# EasyEDA Pro project 示波器_V2.eprj, schematic Schematic1

## Sheets
1 MCU: Board Name: Board1; Create Date: 2023-11-27; Page Name: MCU; Project Name: 手持式多功能示波器; Schematic Name: Schematic1; Update Date: 2025-04-08; Drawed: 一叶知秋; Page Size: A4; Reviewed: 一叶知秋; Version: V1.0
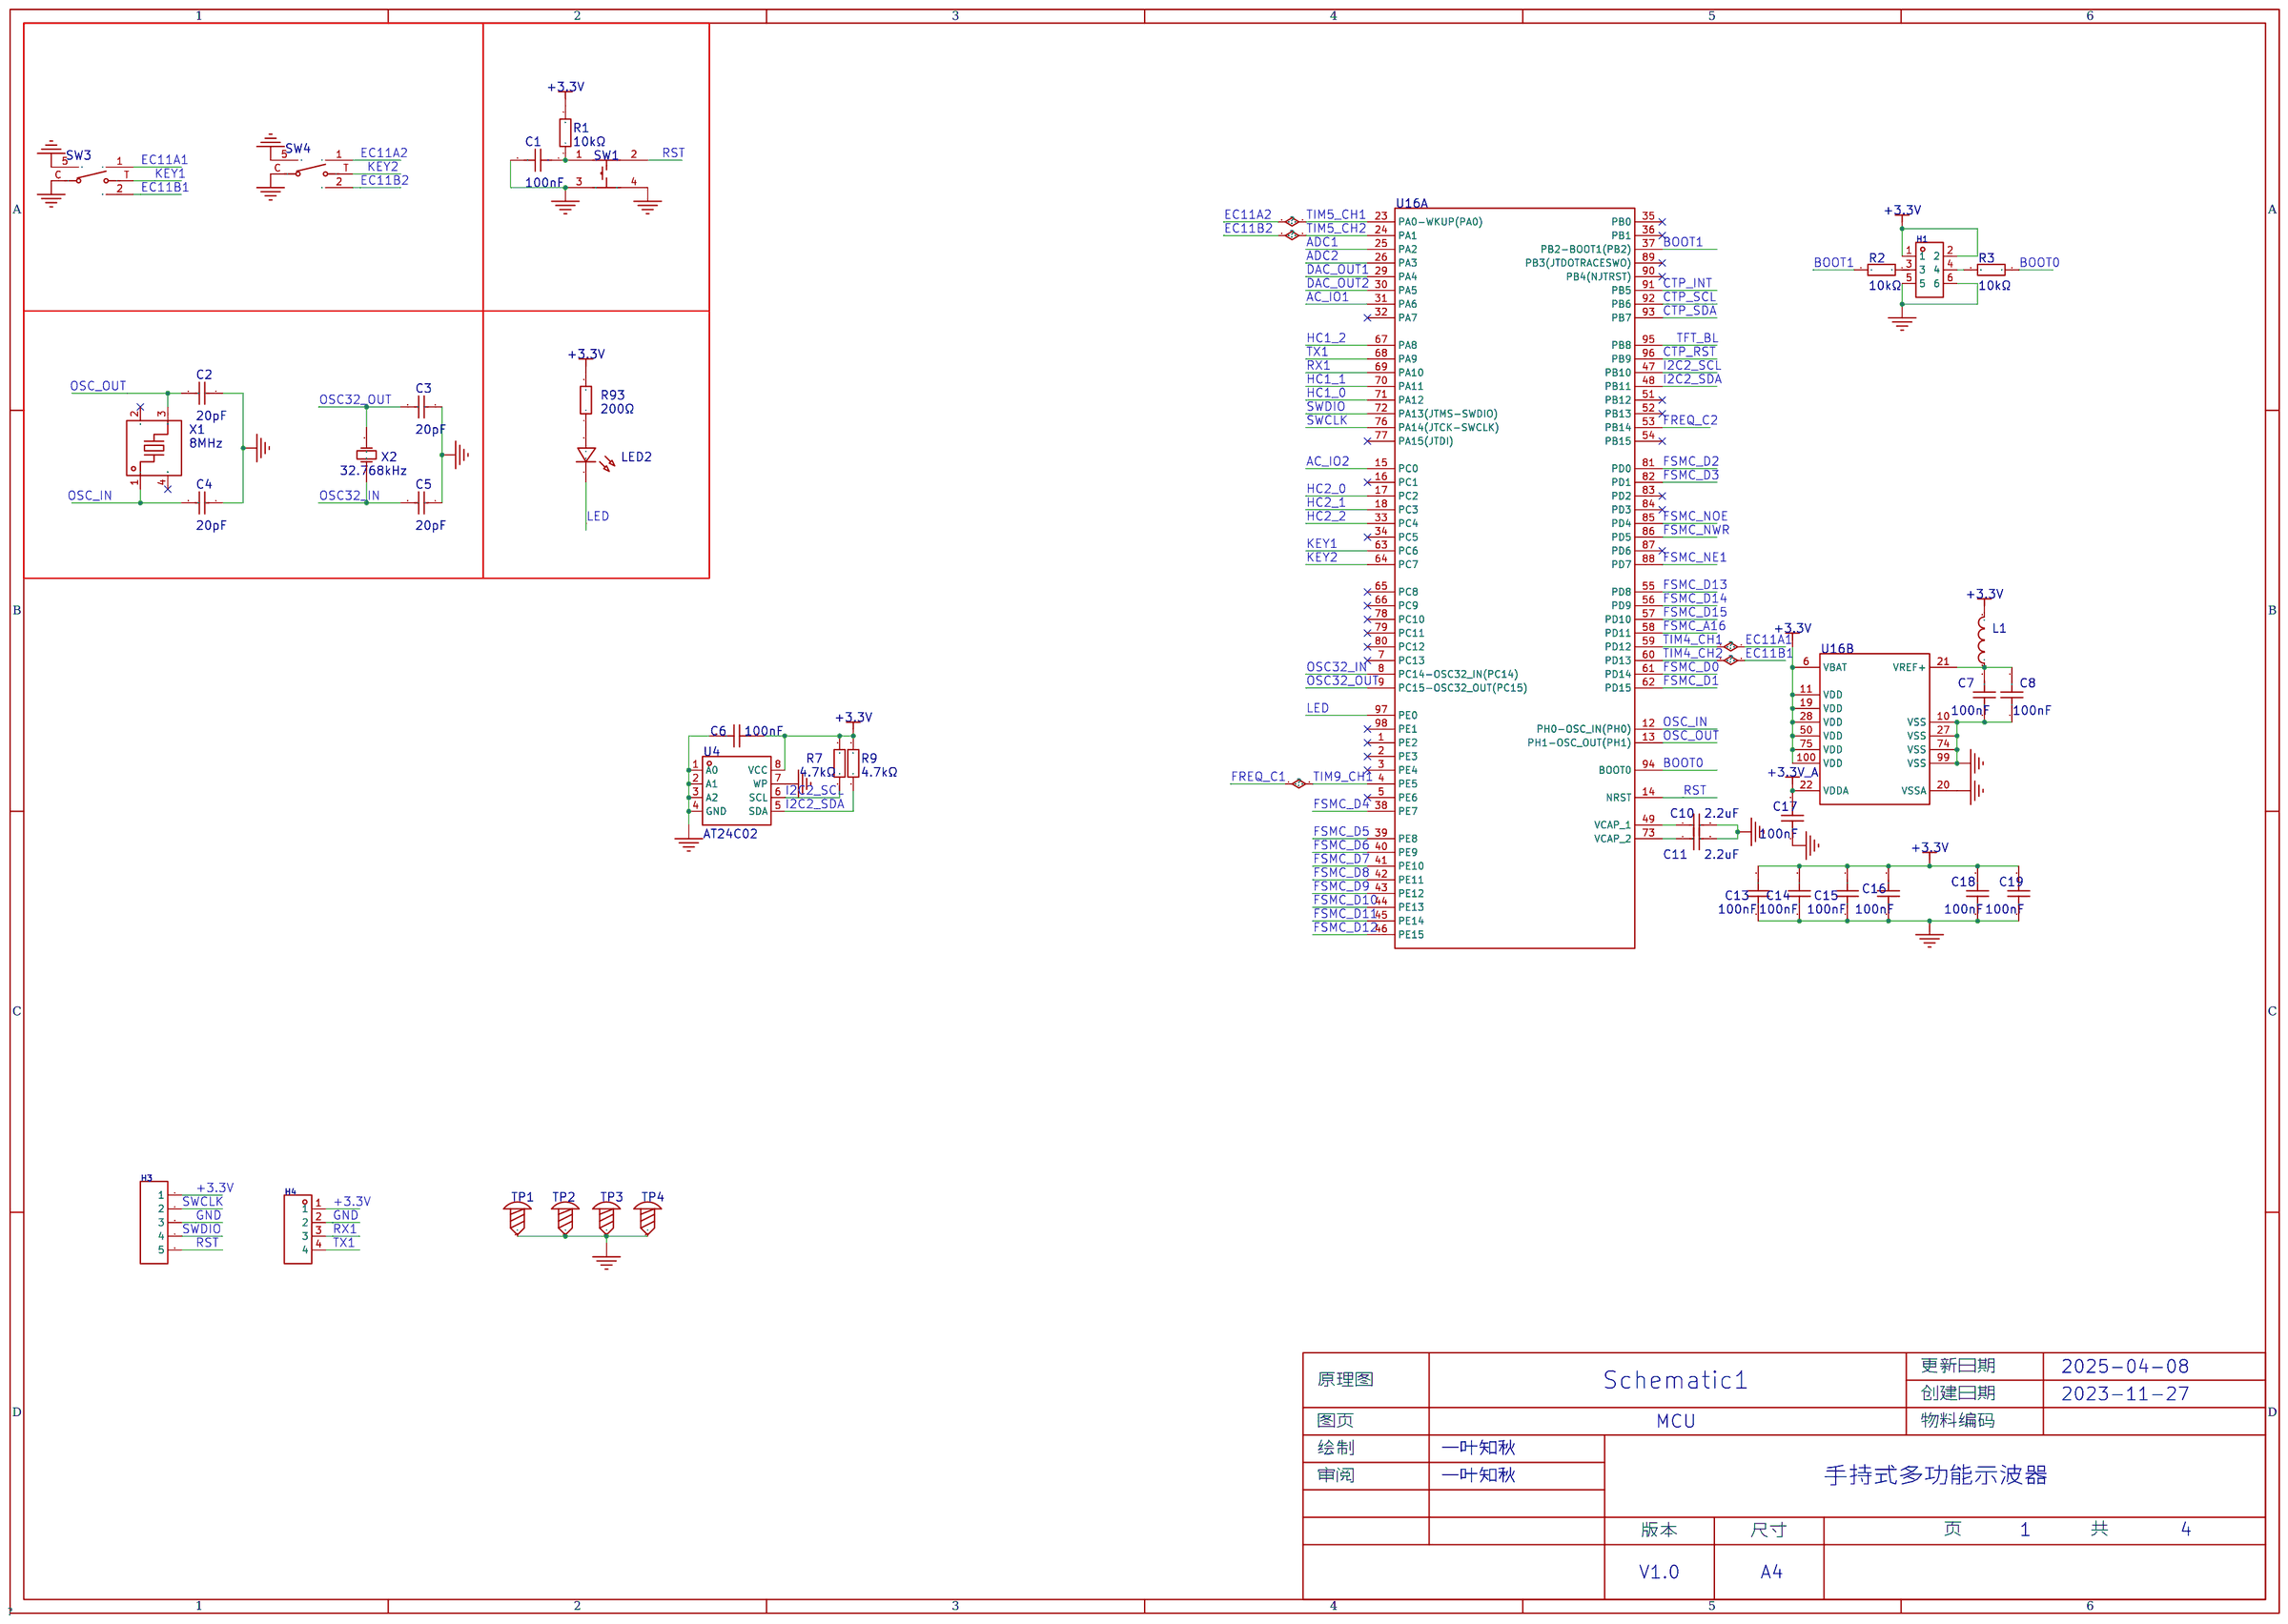
[diagram p0: MCU]
2 电源: Create Date: 2023-10-10; Page Name: 电源; Project Name: STM32F407示波器; Schematic Name: Schematic1_2; Update Date: 2023-10-10
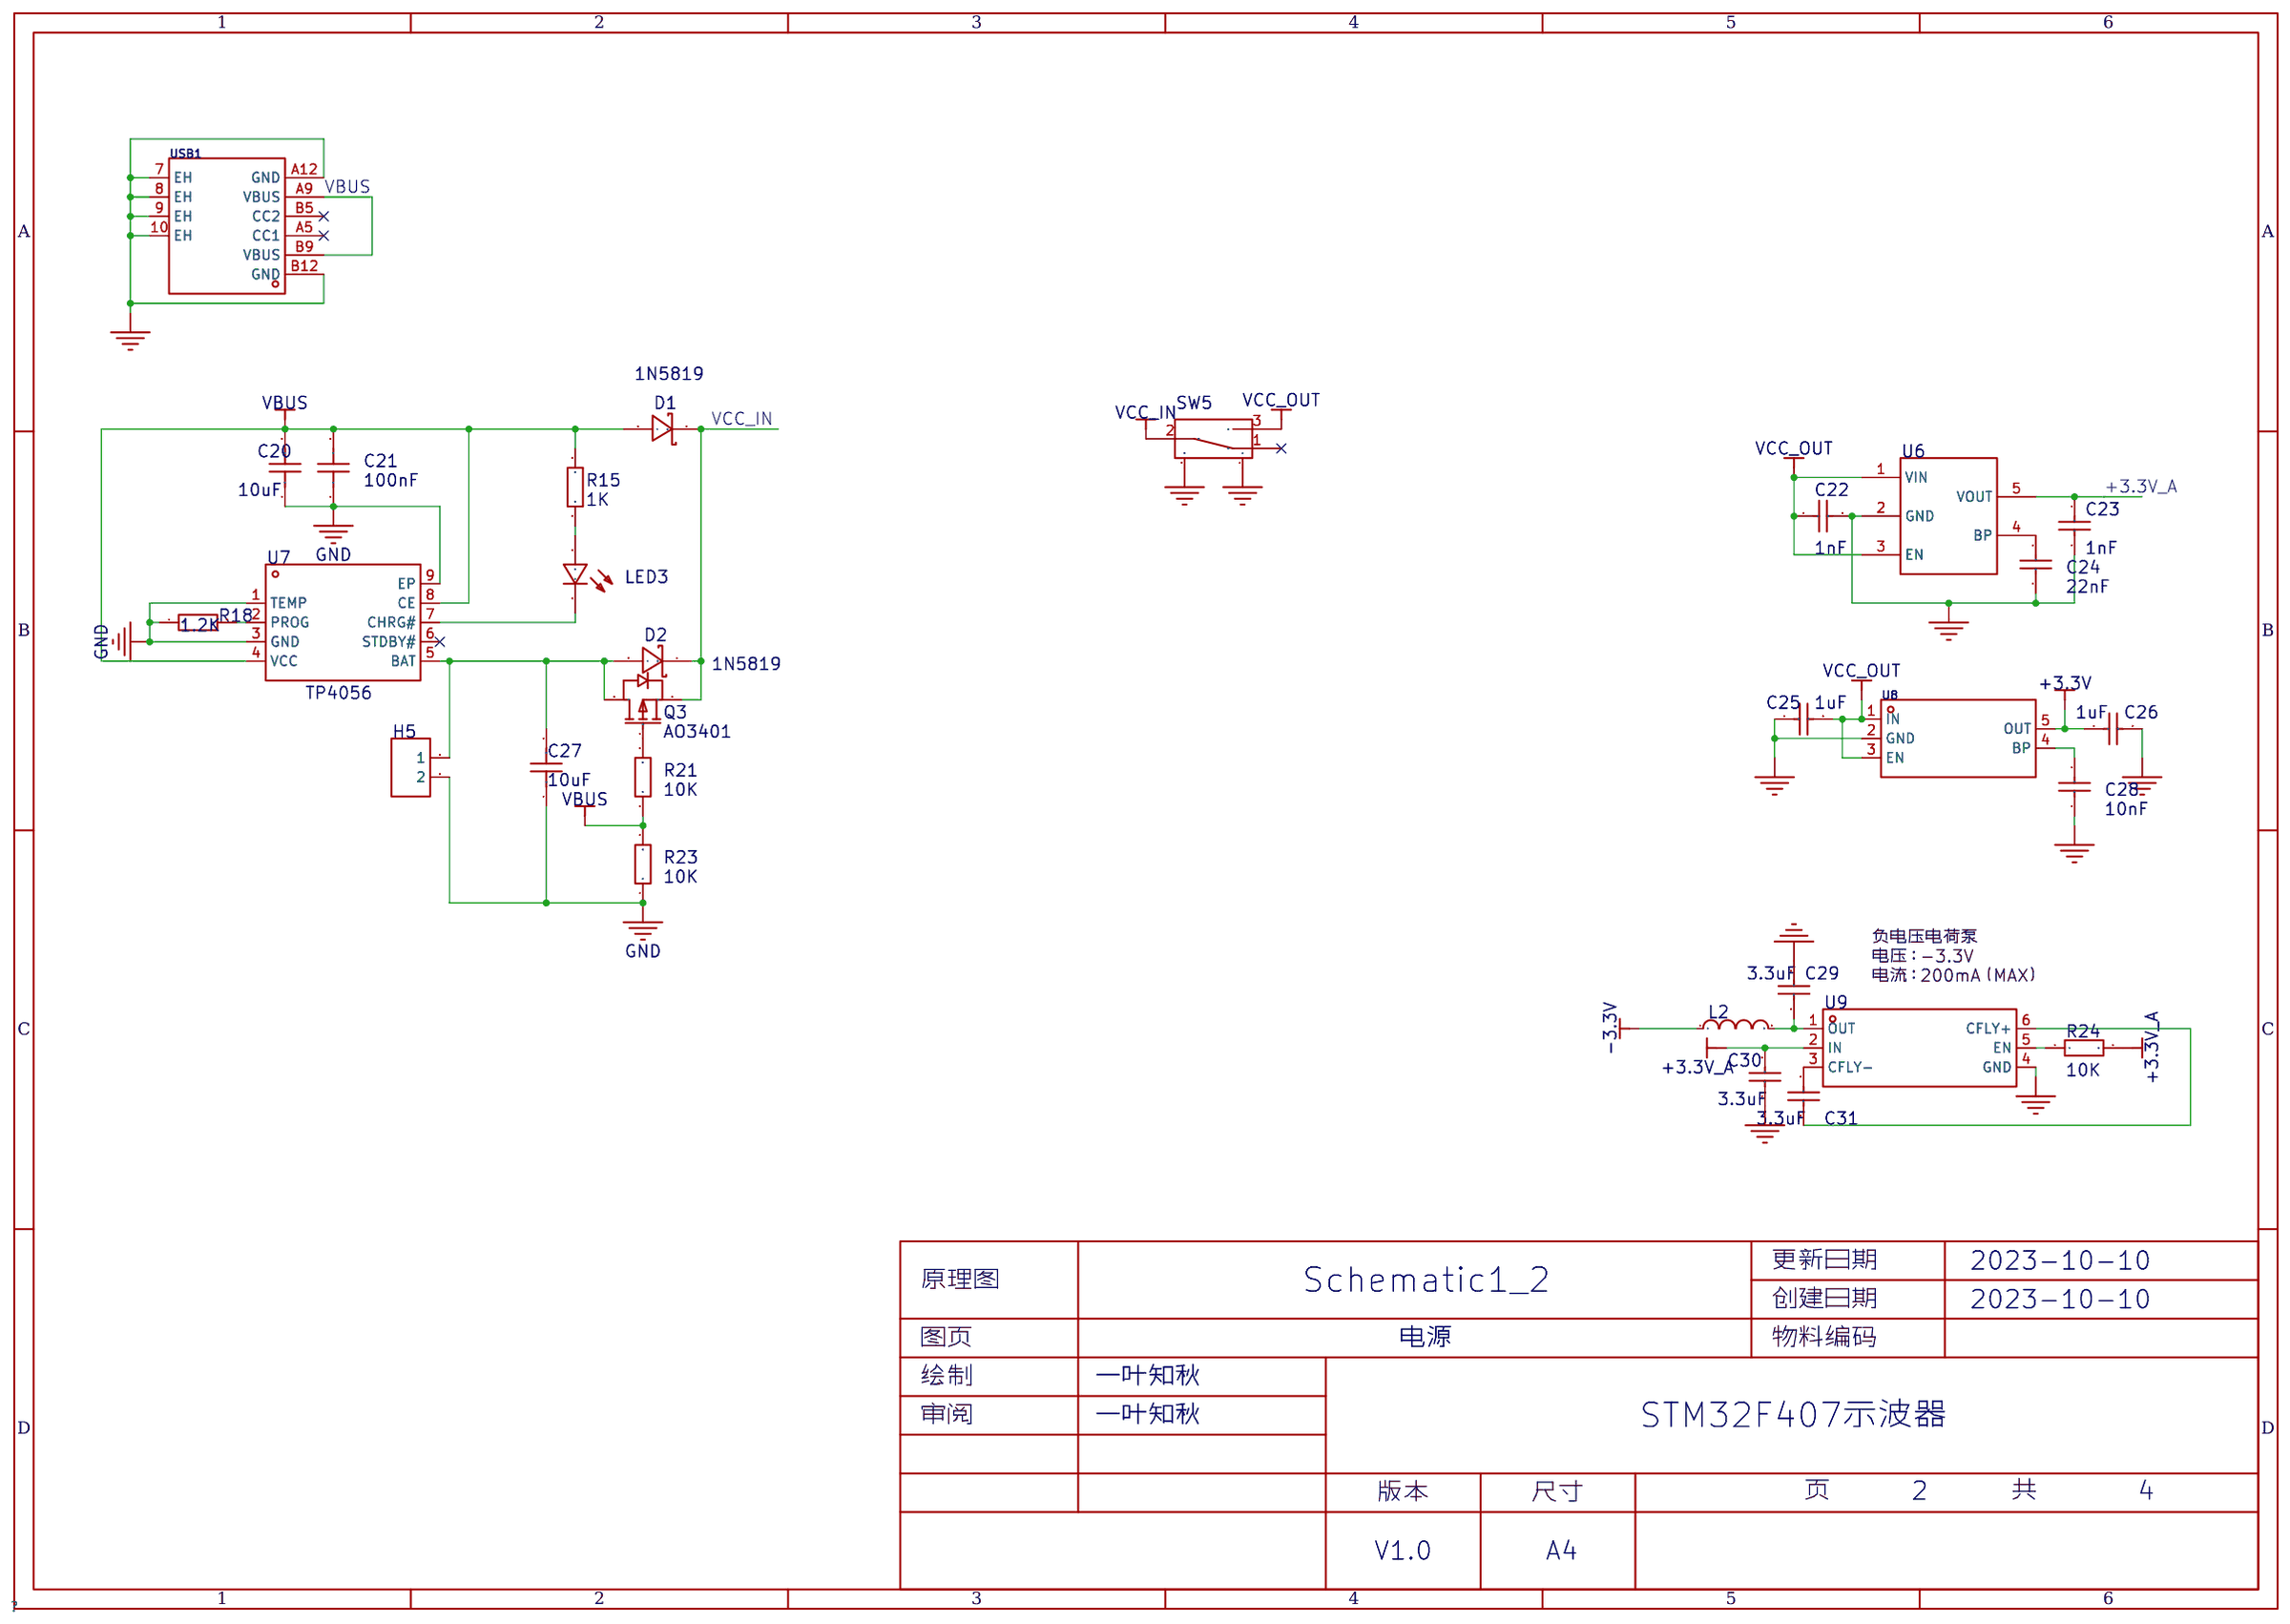
[diagram p1: 电源]
3 屏幕: Create Date: 2023-07-31; Page Name: 屏幕; Project Name: STM32F407示波器; Update Date: 2023-09-07
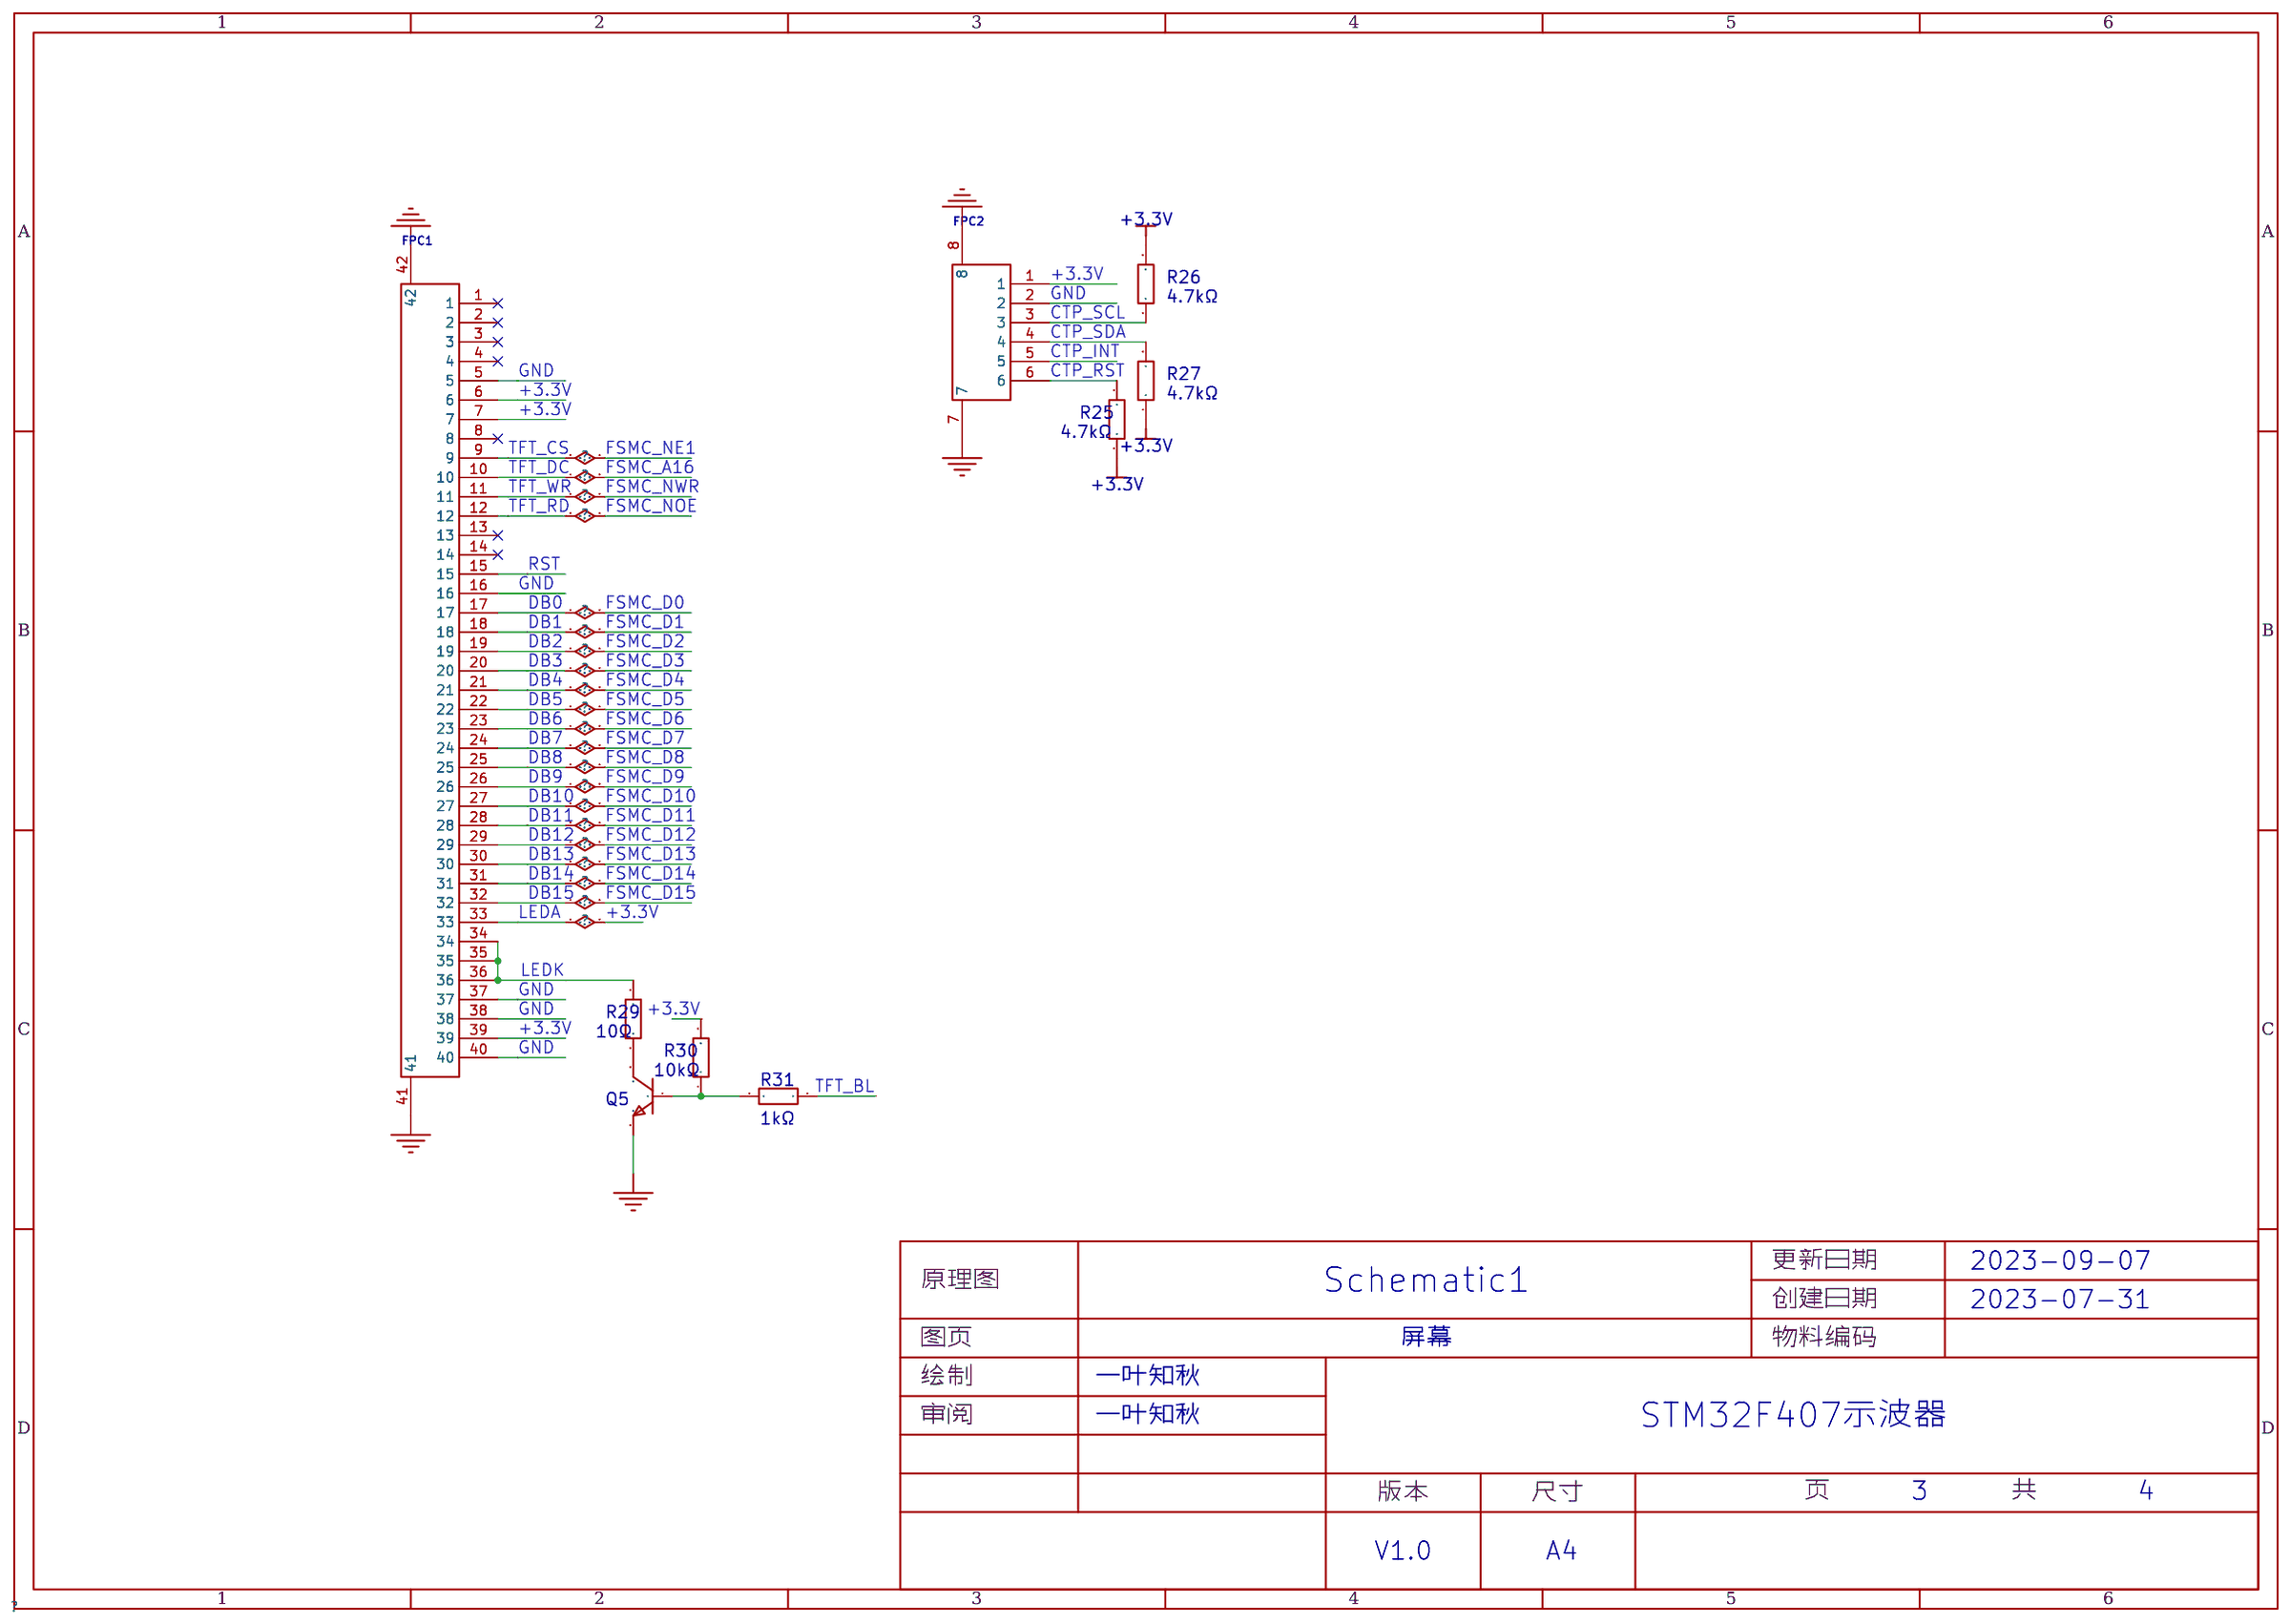
[diagram p2: 屏幕]
4 前级电路: Create Date: 2025-12-03; Page Name: 前级电路; Project Name: 示波器_V2; Update Date: 2025-12-03
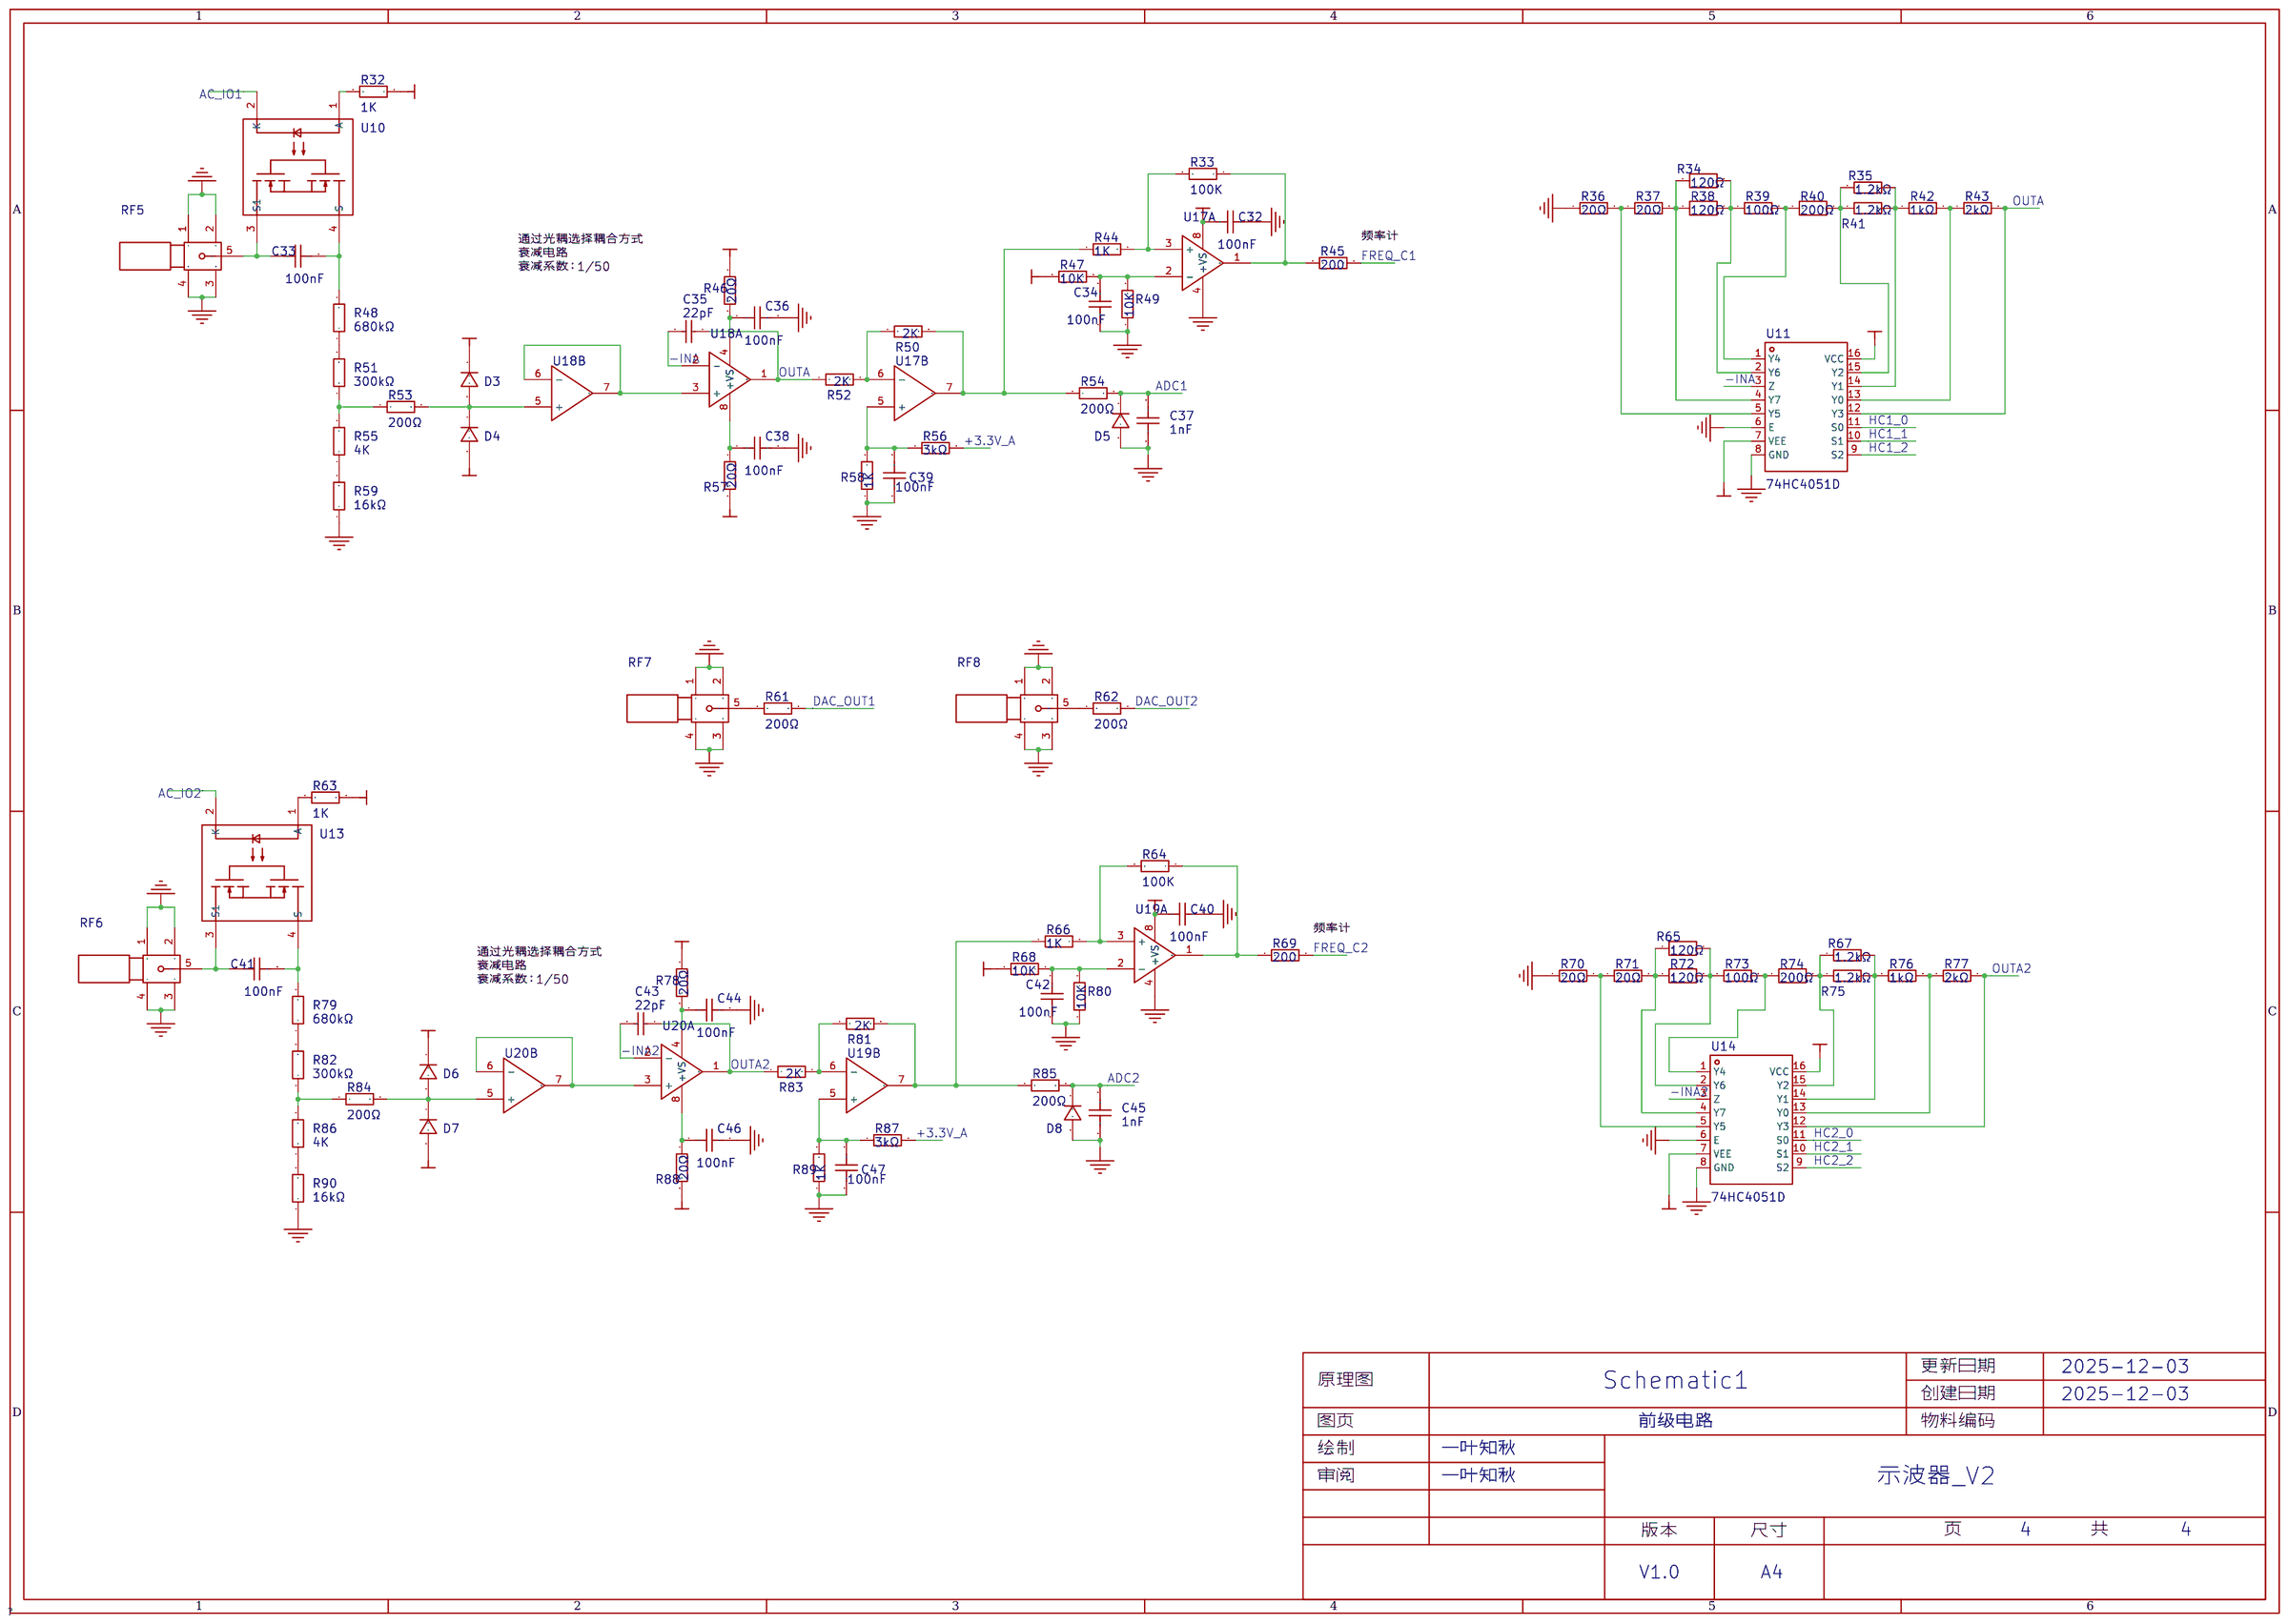
[diagram p3: 前级电路]

## Parts
sheet MCU
C1  100nF  [C0603]
C2  20pF  [C0603]
C3  20pF  [C0603]
C4  20pF  [C0603]
C5  20pF  [C0603]
C6  100nF  [C0603]
C7  100nF  [C0603]
C8  100nF  [C0603]
C10  2.2uF  [C0603]
C11  2.2uF  [C0603]
C13  100nF  [C0603]
C14  100nF  [C0603]
C15  100nF  [C0603]
C16  100nF  [C0603]
C17  100nF  [C0603]
C18  100nF  [C0603]
C19  100nF  [C0603]
H1  PZ254V-12-6P  [HDR-TH_6P-P2.54-V-M-R2-C3-S2.54]
H3  -  [HDR-TH_5P-P2.54-V-F]
H4  -  [HDR-TH_4P-P2.54-V-F]
L1  GZ1608D601TF  [L0603]
LED2  -  [LED_0603]
R1  10kΩ  [R0603]
R2  10kΩ  [R0603]
R3  10kΩ  [R0603]
R7  4.7kΩ  [R0603]
R9  4.7kΩ  [R0603]
R93  200Ω  [R0603]
SW1  SKRPACE010  [KEY-SMD_4P-L4.2-W3.2-P2.20-LS4.6]
SW3  K1-1502SA-01  [KEY-SMD_K1-1502SA-01]
SW4  K1-1502SA-01  [KEY-SMD_K1-1502SA-01]
TP1  -  [M3螺丝]
TP2  -  [M3螺丝]
TP3  -  [M3螺丝]
TP4  -  [M3螺丝]
U4  AT24C02  [SOP-8_L5.0-W4.0-P1.27-LS6.0-BL]
U16  STM32F407VET6  [LQFP-100_L14.0-W14.0-P0.50-LS16.0-BL]  (sections 1,2)
X1  8MHz  [CRYSTAL-SMD_4P-L3.2-W2.5-BL]
X2  32.768kHz  [OSC-TH_BD3.1-P0.8-D0.3]
sheet 前级电路
C32  100nF  [C0603]
C33  100nF  [C1206]
C34  100nF  [C0603]
C35  22pF  [C0603]
C36  100nF  [C0603]
C37  1nF  [C0603]
C38  100nF  [C0603]
C39  100nF  [C0603]
C40  100nF  [C0603]
C41  100nF  [C1206]
C42  100nF  [C0603]
C43  22pF  [C0603]
C44  100nF  [C0603]
C45  1nF  [C0603]
C46  100nF  [C0603]
C47  100nF  [C0603]
D3  1N4148W  [SOD-123_L2.8-W1.8-LS3.7-RD]
D4  1N4148W  [SOD-123_L2.8-W1.8-LS3.7-RD]
D5  1N4148W  [SOD-123_L2.8-W1.8-LS3.7-RD]
D6  1N4148W  [SOD-123_L2.8-W1.8-LS3.7-RD]
D7  1N4148W  [SOD-123_L2.8-W1.8-LS3.7-RD]
D8  1N4148W  [SOD-123_L2.8-W1.8-LS3.7-RD]
R32  1K  [R0603]
R33  100K  [R0603]
R34  120Ω  [R0603]
R35  1.2kΩ  [R0603]
R36  20Ω  [R0603]
R37  20Ω  [R0603]
R38  120Ω  [R0603]
R39  100Ω  [R0603]
R40  200Ω  [R0603]
R41  1.2kΩ  [R0603]
R42  1kΩ  [R0603]
R43  2kΩ  [R0603]
R44  1K  [R0603]
R45  200  [R0603]
R46  20Ω  [R0603]
R47  10K  [R0603]
R48  680kΩ  [R0603]
R49  10K  [R0603]
R50  2K  [R0603]
R51  300kΩ  [R0603]
R52  2K  [R0603]
R53  200Ω  [R0603]
R54  200Ω  [R0603]
R55  4K  [R0603]
R56  3kΩ  [R0603]
R57  20Ω  [R0603]
R58  1K  [R0603]
R59  16kΩ  [R0603]
R61  200Ω  [R0603]
R62  200Ω  [R0603]
R63  1K  [R0603]
R64  100K  [R0603]
R65  120Ω  [R0603]
R66  1K  [R0603]
R67  1.2kΩ  [R0603]
R68  10K  [R0603]
R69  200  [R0603]
R70  20Ω  [R0603]
R71  20Ω  [R0603]
R72  120Ω  [R0603]
R73  100Ω  [R0603]
R74  200Ω  [R0603]
R75  1.2kΩ  [R0603]
R76  1kΩ  [R0603]
R77  2kΩ  [R0603]
R78  20Ω  [R0603]
R79  680kΩ  [R0603]
R80  10K  [R0603]
R81  2K  [R0603]
R82  300kΩ  [R0603]
R83  2K  [R0603]
R84  200Ω  [R0603]
R85  200Ω  [R0603]
R86  4K  [R0603]
R87  3kΩ  [R0603]
R88  20Ω  [R0603]
R89  1K  [R0603]
R90  16kΩ  [R0603]
RF5  BWSMA-KE-P001  [SMA-SMD_BWSMA-KE-P001]
RF6  BWSMA-KE-P001  [SMA-SMD_BWSMA-KE-P001]
RF7  BWSMA-KE-P001  [SMA-SMD_BWSMA-KE-P001]
RF8  BWSMA-KE-P001  [SMA-SMD_BWSMA-KE-P001]
U10  KAQY214STLD  [SOP-4_L3.9-W4.4-P2.54-LS7.0-BR]
U11  74HC4051D  [SOIC-16_L9.9-W3.9-P1.27-LS6.0-BL]
U13  KAQY214STLD  [SOP-4_L3.9-W4.4-P2.54-LS7.0-BR]
U14  74HC4051D  [SOIC-16_L9.9-W3.9-P1.27-LS6.0-BL]
U17  TP2604-SR  [SOIC-8_L4.9-W3.9-P1.27-LS6.0-BL]  (sections 1,2)
U18  TP2604-SR  [SOIC-8_L4.9-W3.9-P1.27-LS6.0-BL]  (sections 1,2)
U19  TP2604-SR  [SOIC-8_L4.9-W3.9-P1.27-LS6.0-BL]  (sections 1,2)
U20  TP2604-SR  [SOIC-8_L4.9-W3.9-P1.27-LS6.0-BL]  (sections 1,2)
sheet 屏幕
FPC1  AFC01-S40FCA-00  [FPC-SMD_P0.50-40P_FGS-XJ-H2.0]
FPC2  AFC01-S06FCA-00  [FPC-SMD_P0.50-6P_AFC01-S06FCA-00]
Q5  S8050  [SOT-23-3_L2.9-W1.6-P1.90-LS2.8-BR]
R25  4.7kΩ  [R0603]
R26  4.7kΩ  [R0603]
R27  4.7kΩ  [R0603]
R29  10Ω  [R0603]
R30  10kΩ  [R0603]
R31  1kΩ  [R0603]
sheet 电源
C20  10uF  [C0603]
C21  100nF  [C0603]
C22  1nF  [C0603]
C23  1nF  [C0603]
C24  22nF  [C0603]
C25  1uF  [C0603]
C26  1uF  [C0603]
C27  10uF  [C0603]
C28  10nF  [C0603]
C29  3.3uF  [C0603]
C30  3.3uF  [C0603]
C31  3.3uF  [C0603]
D1  1N5819  [SMA_L4.4-W2.6-LS5.0-RD]
D2  1N5819  [SMA_L4.4-W2.6-LS5.0-RD]
H5  -  [HDR-TH_2P-P2.54-V-F]
L2  GZ1608D601TF  [L0603]
LED3  204-10SURD/S530-A3-L  [LED-TH_BD3.0-P2.54-FD]
Q3  AO3401  [SOT-23-3_L2.9-W1.4-P1.90-LS2.6-BR]
R15  1K  [R0603]
R18  1.2K  [R0603]
R21  10K  [R0603]
R23  10K  [R0603]
R24  10K  [R0603]
SW5  -  [拨动开关_侧]
U6  RT9193-33GB  [SOT-23-5_L3.0-W1.7-P0.95-LS2.8-BL]
U7  TP4056  [ESOP-8_L4.9-W3.9-P1.27-LS6.0-BL-EP]
U8  RS3236-3.3YF5  [SOT-23-5_L3.0-W1.7-P0.95-LS2.8-BR]
U9  SGM3204YN6G/TR  [SOT-23-6_L2.9-W1.6-P0.95-LS2.8-BR]
USB1  U262-061N-4BVC11  [USB-SMD_U262-061N-4BVC11]

## Library data of the parts
C1 C6-C8 C13-C19 C36 C38 C44 C46 = CC0603KRX7R9BB104: 容值:100nF;精度:±10%;额定电压:50V;材质(温度系数):X7R;; LCSC Part Name: 100nF ±10% 50V; Supplier Part: C14663; Manufacturer: YAGEO(国巨); Supplier Footprint: 0603; JLCPCB Part Class: Basic Part; Datasheet: https://atta.szlcsc.com/upload/public/pdf/source/20180910/C282072_33301C7F631E79921B82A8DAC6BCC5B3.pdf; Supplier: LCSC; Tolerance: ±10%; Voltage Rated: 50V; Temperature Coefficient: X7R
C2-C5 = CC0603JRNPO9BN200: 容值:20pF;精度:±5%;额定电压:50V;材质(温度系数):NP0;; LCSC Part Name: 20pF ±5% 50V; Supplier Part: C105621; Manufacturer: YAGEO(国巨); Supplier Footprint: 0603; JLCPCB Part Class: Extended Part; Datasheet: https://atta.szlcsc.com/upload/public/pdf/source/20170425/1493115771885.pdf; Supplier: LCSC; Tolerance: ±5%; Voltage Rated: 50V; Temperature Coefficient: NP0
C10 C11 = CL10A225KO8NNNC: 容值:2.2uF;精度:±10%;额定电压:16V;材质(温度系数):X5R;; LCSC Part Name: 2.2uF ±10% 16V; Supplier Part: C23630; Manufacturer: SAMSUNG(三星); Supplier Footprint: 0603; JLCPCB Part Class: 基础库; Datasheet: https://atta.szlcsc.com/upload/public/pdf/source/20160103/1457707709512.pdf; Supplier: LCSC; Tolerance: ±10%; Voltage Rated: 16V; Temperature Coefficient: X5R
H1 = PZ254V-12-6P: 排数:双排;总PIN位数:6P;间距:2.54mm;插针结构:2x3P;行距:2.54mm;安装类型:直插;圆针/方针:方针;额定电流:-;额定电压:-;配合针长度:6mm;塑高:2.5mm;端接针长度:3mm;触头材质:黄铜;触头镀层:-;工作温度范围:-40℃~+105℃;颜色:黑色;; LCSC Part Name: 2.54mm 2x3P 直插 方针; Supplier Part: C492420; Manufacturer: XFCN(兴飞); Supplier Footprint: 插件,P=2.54mm; JLCPCB Part Class: 扩展库; Datasheet: https://atta.szlcsc.com/upload/public/pdf/source/20200309/C492420_BAECB307B001054C09D200388220EAE6.pdf; Supplier: LCSC; Number of Rows: 双排; Number of Pins: 6P; Pitch: 2.54mm; Pin Structure: 2x3P; Row Spacing: 2.54mm; Mounting Type: 直插; Circluar Pins/Square Pins: 方针; Length of Mating Pin: 6mm; Insulation Height: 2.5mm; Length of End Connection Pin: 3mm; Contact Material: 黄铜; Operating Temperature Range: -40℃~+105℃; Color: 黑色
H3 = HDR-F_2.54_1x5P: Supplier Part: C50950; Supplier Footprint: 插件
H4 = HDR-F_2.54_1x4P: Supplier Part: C2718488; Supplier Footprint: 插件
L1 = GZ1608D601TF: 标称阻抗@测试频率:600Ω@100MHz;误差:±25%;直流电阻(RDC):450mΩ;; LCSC Part Name: 单路 0603磁珠 阻抗600Ω@100MHz; Supplier Part: C1002; Manufacturer: Sunlord(顺络); Supplier Footprint: 0603; JLCPCB Part Class: 基础库; Datasheet: https://atta.szlcsc.com/upload/public/pdf/source/20210830/355EA7C0FAC5394FC0FE3F17C770C20A.pdf; Supplier: LCSC; Impedance @ Frequency: 600Ω@100MHz; Tolerance: ±25%; DC Resistance: 450mΩ; Current Rating: 200mA; Circuits: 1
LED2 = LED_0603-G: Supplier Footprint: 0603
R1-R3 R30 = 0603WAF1002T5E: 电阻类型:厚膜电阻;阻值:10kΩ;精度:±1%;功率:100mW;; LCSC Part Name: 厚膜电阻 10kΩ ±1% 100mW; Supplier Part: C25804; Manufacturer: UNI-ROYAL(厚声); Supplier Footprint: 0603; JLCPCB Part Class: Basic Part; Datasheet: https://atta.szlcsc.com/upload/public/pdf/source/20200306/C422600_1E6D84923E4A46A82E41ADD87F860B5C.pdf; Supplier: LCSC; Type: 厚膜电阻; Tolerance: ±1%; Power(Watts): 100mW; Temperature Coefficient: ±100ppm/℃; Overload Voltage (Max): 75V; Operating Temperature Range: -55℃~+155℃
R7 R9 R25-R27 = 0603WAF4701T5E: 电阻类型:厚膜电阻;阻值:4.7kΩ;精度:±1%;功率:100mW;; LCSC Part Name: 4.7kΩ ±1% 100mW; Supplier Part: C23162; Manufacturer: UNI-ROYAL(厚声); Supplier Footprint: 0603; JLCPCB Part Class: Basic Part; Datasheet: https://atta.szlcsc.com/upload/public/pdf/source/20200306/C422600_1E6D84923E4A46A82E41ADD87F860B5C.pdf; Supplier: LCSC; Type: 厚膜电阻; Tolerance: ±1%; Power(Watts): 100mW; Temperature Coefficient: ±100ppm/℃; Overload Voltage (Max): 75V; Operating Temperature Range: -55℃~+155℃
R53 R54 R61 R62 R84 R85 R93 = 0603WAF2000T5E: 电阻类型:厚膜电阻;阻值:200Ω;精度:±1%;功率:100mW;; LCSC Part Name: 200Ω ±1% 100mW; Supplier Part: C8218; Manufacturer: UNI-ROYAL(厚声); Supplier Footprint: 0603; JLCPCB Part Class: Basic Part; Datasheet: https://atta.szlcsc.com/upload/public/pdf/source/20200306/C422600_1E6D84923E4A46A82E41ADD87F860B5C.pdf; Supplier: LCSC; Type: 厚膜电阻; Tolerance: ±1%; Power(Watts): 100mW; Temperature Coefficient: ±100ppm/℃; Overload Voltage (Max): 75V; Operating Temperature Range: -55℃~+155℃
SW1 = SKRPACE010: 触点电流:50mA;额定电压(DC):16V;电路结构:单刀单掷;安装方式:立贴;带灯:-;机械寿命:-;; LCSC Part Name: 4.2*3.2*2.5mm 立贴 轻触开关; Supplier Part: C139797; Manufacturer: ALPSALPINE(阿尔卑斯阿尔派); Supplier Footprint: SMD; JLCPCB Part Class: Extended Part; Datasheet: https://atta.szlcsc.com/upload/public/pdf/source/20171113/C139797_15105612676371115729.pdf; Supplier: LCSC; Contact Current: 50mA; Voltage Rating (DC): 16V; Circuit: 单刀单掷; Mounting Style: 立贴; Actuator Style: 椭圆形按钮; Switch Length: 4.2mm; Switch Width: 3.2mm; Switch Height: 2.5mm
SW3 SW4 = K1-1502SA-01: Supplier Part: C145915; Manufacturer: 韩国韩荣; Supplier Footprint: 12.4*11.8mm; JLCPCB Part Class: 扩展库; Datasheet: https://atta.szlcsc.com/upload/public/pdf/source/20210810/68556D289DEA90EEE2C9C67C3CF0D02D.pdf; Supplier: LCSC
TP1-TP4 = M3螺丝: Supplier Footprint: 插件
U4 = AT24C02_C688857: Supplier Part: C688857; Manufacturer: IDCHIP(英锐芯); Supplier Footprint: SOP-8; JLCPCB Part Class: 扩展库; Datasheet: https://atta.szlcsc.com/upload/public/pdf/source/20200619/C688857_168265888F77B455D6D4136881F4BB15.pdf; Supplier: LCSC
U16 = STM32F407VET6: CPU内核:ARM Cortex-M4;CPU最大主频:168MHz;工作电压范围:1.8V~3.6V;内部振荡器:有;程序 FLASH容量:512K@x8bit;RAM总容量:192KB;EEPROM/数据 FLASH容量:-;GPIO端口数量:82;ADC(单元数/通道数/位数):1@x16ch/12bit;DAC(单元数/通道数/位数):1@x2ch/12bit;外设/功能/协议栈:欠压检测/复位；DMA；LCD驱动；看门狗；POR；PWM;工作温度范围:-40℃~+85℃;; LCSC Part Name: ARM Cortex-M4 168MHz 闪存：512K@x8bit RAM：192KB; Supplier Part: C28730; Manufacturer: ST(意法半导体); Supplier Footprint: LQFP-100(14x14); JLCPCB Part Class: Extended Part; Datasheet: https://atta.szlcsc.com/upload/public/pdf/source/20140322/1457707027869.pdf; Supplier: LCSC; CPU Core: ARM Cortex-M4; Maximum Frequency: 168MHz; Supply Voltage Range: 1.8V~3.6V; Internal Oscillator: 有; Program FLASH Size: 512K@x8bit; RAM Size: 192KB; GPIO Ports Number: 82; ADC (Units/Channels/bits): 1@x16ch/12bit; DAC (Units/Channels/bits): 1@x2ch/12bit; Peripherals / Functions / Protocol Stacks: 欠压检测/复位；DMA；LCD驱动；看门狗；POR；PWM; Operating Temperature Range: -40℃~+85℃
X1 = X32258MSB4SI: 频率:8MHz;频率公差:±10ppm;负载电容:20pF;; LCSC Part Name: 8MHz ±10ppm 20pF YSX321SL; Supplier Part: C2682774; Manufacturer: YXC(扬兴晶振); Supplier Footprint: SMD3225-4P; JLCPCB Part Class: Extended Part; Datasheet: https://atta.szlcsc.com/upload/public/pdf/source/20210106/C2682774_0CD4FDA5D9DA3FBEEC23BD607A48E4B0.pdf; Supplier: LCSC; Crystal Type: 贴片无源晶振; Frequency Tolerance: ±10ppm; Frequency Stability: ±30ppm; Load Capacitance: 20pF; Operating Temperature: -40℃~+85℃
X2 = X308032768KGB2SC: 频率:32.768kHz;频率公差:±10ppm;负载电容:12.5pF;; LCSC Part Name: 32.768kHz ±10ppm 12.5pF YT-38; Supplier Part: C52082; Manufacturer: YXC(扬兴晶振); Supplier Footprint: DT-38; JLCPCB Part Class: 扩展库; Datasheet: https://atta.szlcsc.com/upload/public/pdf/source/20210729/394323D37097DADF5DA3ECA9C1DCF4BF.pdf; Supplier: LCSC; Crystal Type: 圆柱体晶振; Frequency Tolerance: ±10ppm; Load Capacitance: 12.5pF; Operating Temperature: -20℃~+70℃
C20 C21 C27 C32 C34 C39 C40 C42 C47 = CAP_0603: Supplier Footprint: 0603
C33 C41 = 1206B104K251NT_C2909525: 容值:100nF;精度:±10%;额定电压:250V;材质(温度系数):X7R;; LCSC Part Name: 100nF ±10% 250V; Supplier Part: C2909525; Manufacturer: FH(风华); Manufacturer Part: 1206B104K251NT; Supplier Footprint: 1206; JLCPCB Part Class: Extended Part; Datasheet: https://atta.szlcsc.com/upload/public/pdf/source/20211026/1B9CC6FF40D574A190437DF0D5F8F6A6.pdf; Supplier: LCSC; Tolerance: ±10%; Voltage Rated: 250V; Temperature Coefficient: X7R
C35 C43 = CC0603JRNPO9BN220: 容值:22pF;精度:±5%;额定电压:50V;材质(温度系数):NP0;; LCSC Part Name: 22pF ±5% 50V; Supplier Part: C105620; Manufacturer: YAGEO(国巨); Supplier Footprint: 0603; JLCPCB Part Class: Extended Part; Datasheet: https://atta.szlcsc.com/upload/public/pdf/source/20170425/1493115771353.pdf; Supplier: LCSC; Tolerance: ±5%; Voltage Rated: 50V; Temperature Coefficient: NP0
C37 C45 = 0603N102J500CT: 容值:1nF;精度:±5%;额定电压:50V;材质(温度系数):NP0;; LCSC Part Name: 1nF ±5% 50V; Supplier Part: C340644; Manufacturer: Walsin(华新科); Supplier Footprint: 0603; JLCPCB Part Class: Extended Part; Datasheet: https://atta.szlcsc.com/upload/public/pdf/source/20181207/C340644_AB1BD93B8E3DFFAEA6E9DDD2AD6B5F50.pdf; Supplier: LCSC; Tolerance: ±5%; Voltage Rated: 50V; Temperature Coefficient: NP0
D3-D8 = 1N4148W_C2099: 二极管配置:独立式;功率:500mW;直流反向耐压(Vr):100V;平均整流电流(Io):150mA;正向压降(Vf):1.25V@150mA;反向电流(Ir):1uA@75V;反向恢复时间(trr):4ns;工作温度:+150℃@(Tj);; LCSC Part Name: 100V 150mA 4ns T4; Supplier Part: C2099; Manufacturer: CJ(江苏长电/长晶); Supplier Footprint: SOD-123; JLCPCB Part Class: Extended Part; Datasheet: https://atta.szlcsc.com/upload/public/pdf/source/20120428/1457706480199.pdf; Supplier: LCSC; Diode Configuration: 独立式; Power Dissipation: 500mW; Reverse Voltage (Vr): 100V; Average Rectified Current (Io): 150mA; Forward Voltage (Vf@If): 1.25V@150mA; Reverse Leakage Current: 1uA@75V; Reverse Recovery Time (trr): 4ns; Operating Temperature: +150℃@(Tj)
R15 R18 R21 R23 R24 R32 R33 R44 R45 R47 R49 R50 R52 R58 R63 R64 R66 R68 R69 R80 R81 R83 R89 = Res_0603: Supplier Footprint: 0603
R34 R38 R65 R72 = AR03BTCX1200: 电阻类型:薄膜电阻;阻值:120Ω;精度:±0.1%;功率:100mW;; LCSC Part Name: 120Ω ±0.1% 100mW; Supplier Part: C2828631; Manufacturer: Viking(光颉); Supplier Footprint: 0603; JLCPCB Part Class: Extended Part; Datasheet: https://atta.szlcsc.com/upload/public/pdf/source/20211009/C2828631_CB7E5025206F65E2B3DE5440F8A20222.pdf; Supplier: LCSC; Type: 薄膜电阻; Tolerance: ±0.1%; Power(Watts): 100mW; Temperature Coefficient: ±25ppm/℃; Overload Voltage (Max): 50V; Operating Temperature Range: -55℃~+155℃
R35 R41 R67 R75 = RT0603BRE071K2L: 电阻类型:薄膜电阻;阻值:1.2kΩ;精度:±0.1%;功率:100mW;; LCSC Part Name: 1.2kΩ ±0.1% 100mW; Supplier Part: C375504; Manufacturer: YAGEO(国巨); Supplier Footprint: 0603; JLCPCB Part Class: Extended Part; Datasheet: https://atta.szlcsc.com/upload/public/pdf/source/20190227/C375504_4180BCDC4FF3B91996E1D8C22B6264EE.pdf; Supplier: LCSC; Type: 薄膜电阻; Tolerance: ±0.1%; Power(Watts): 100mW; Temperature Coefficient: ±50ppm/℃; Overload Voltage (Max): 75V; Operating Temperature Range: -55℃~+155℃
R36 R37 R70 R71 = AR03BTCX0200: 阻值:20Ω;精度:±0.1%;功率:100mW;; LCSC Part Name: 20Ω ±0.1% 100mW; Supplier Part: C319749; Manufacturer: Viking(光颉); Supplier Footprint: 0603; JLCPCB Part Class: Extended Part; Datasheet: https://atta.szlcsc.com/upload/public/pdf/source/20181130/C319749_C18EFB08CB3EEAF42C1DDC05C2EC012B.pdf; Supplier: LCSC; Tolerance: ±0.1%; Power(Watts): 100mW; Temperature Coefficient: ±25ppm/℃
R39 R73 = RT0603BRD07100RL: 电阻类型:薄膜电阻;阻值:100Ω;精度:±0.1%;功率:100mW;; LCSC Part Name: 100Ω ±0.1% 100mW; Supplier Part: C122970; Manufacturer: YAGEO(国巨); Supplier Footprint: 0603; JLCPCB Part Class: Extended Part; Datasheet: https://atta.szlcsc.com/upload/public/pdf/source/20170728/C122970_1501225762145848821.pdf; Supplier: LCSC; Type: 薄膜电阻; Tolerance: ±0.1%; Power(Watts): 100mW; Temperature Coefficient: ±25ppm/℃; Overload Voltage (Max): 75V; Operating Temperature Range: -55℃~+155℃
R40 R74 = TD03G2000BT: 阻值:200Ω;精度:±0.1%;功率:100mW;; LCSC Part Name: 200Ω ±0.1% 100mW; Supplier Part: C666839; Manufacturer: FH(风华); Supplier Footprint: 0603; JLCPCB Part Class: Extended Part; Datasheet: https://atta.szlcsc.com/upload/public/pdf/source/20200616/C657321_2CFA27FA726BC0D0F6223AF922169515.pdf; Supplier: LCSC; Tolerance: ±0.1%; Power(Watts): 100mW; Temperature Coefficient: ±25ppm/℃; Overload Voltage (Max): 50V; Operating Temperature Range: -55℃~+155℃
R42 R76 = RT0603BRD071KL: 电阻类型:薄膜电阻;阻值:1kΩ;精度:±0.1%;功率:100mW;; LCSC Part Name: 1kΩ ±0.1% 100mW; Supplier Part: C110776; Manufacturer: YAGEO(国巨); Supplier Footprint: 0603; JLCPCB Part Class: Extended Part; Datasheet: https://atta.szlcsc.com/upload/public/pdf/source/20170704/1499151282044.pdf; Supplier: LCSC; Type: 薄膜电阻; Tolerance: ±0.1%; Power(Watts): 100mW; Temperature Coefficient: ±25ppm/℃; Overload Voltage (Max): 75V; Operating Temperature Range: -55℃~+155℃
R43 R77 = ARG03BTC2001: 电阻类型:薄膜电阻;阻值:2kΩ;精度:±0.1%;功率:100mW;; LCSC Part Name: 2kΩ ±0.1% 100mW; Supplier Part: C335077; Manufacturer: Viking(光颉); Supplier Footprint: 0603; JLCPCB Part Class: Extended Part; Datasheet: https://atta.szlcsc.com/upload/public/pdf/source/20181130/C335077_33AD6C01923ABAA90C0162F8867C46C9.pdf; Supplier: LCSC; Type: 薄膜电阻; Tolerance: ±0.1%; Power(Watts): 100mW; Temperature Coefficient: ±25ppm/℃; Overload Voltage (Max): 75V; Operating Temperature Range: -55℃~+155℃
R46 R57 R78 R88 = 0603WAF200JT5E: 电阻类型:厚膜电阻;阻值:20Ω;精度:±1%;功率:100mW;; LCSC Part Name: 20Ω ±1% 100mW; Supplier Part: C22950; Manufacturer: UNI-ROYAL(厚声); Supplier Footprint: 0603; JLCPCB Part Class: Basic Part; Datasheet: https://atta.szlcsc.com/upload/public/pdf/source/20200306/C422600_1E6D84923E4A46A82E41ADD87F860B5C.pdf; Supplier: LCSC; Type: 厚膜电阻; Tolerance: ±1%; Power(Watts): 100mW; Temperature Coefficient: ±100ppm/℃; Overload Voltage (Max): 75V; Operating Temperature Range: -55℃~+155℃
R48 R79 = 0603WAF6803T5E: 电阻类型:厚膜电阻;阻值:680kΩ;精度:±1%;功率:100mW;; LCSC Part Name: 680kΩ ±1% 100mW; Supplier Part: C25822; Manufacturer: UNI-ROYAL(厚声); Supplier Footprint: 0603; JLCPCB Part Class: Basic Part; Datasheet: https://atta.szlcsc.com/upload/public/pdf/source/20200306/C422600_1E6D84923E4A46A82E41ADD87F860B5C.pdf; Supplier: LCSC; Type: 厚膜电阻; Tolerance: ±1%; Power(Watts): 100mW; Temperature Coefficient: ±100ppm/℃; Overload Voltage (Max): 75V; Operating Temperature Range: -55℃~+155℃
R51 R82 = 0603WAF3003T5E: 电阻类型:厚膜电阻;阻值:300kΩ;精度:±1%;功率:100mW;; LCSC Part Name: 300kΩ ±1% 100mW; Supplier Part: C23024; Manufacturer: UNI-ROYAL(厚声); Supplier Footprint: 0603; JLCPCB Part Class: Basic Part; Datasheet: https://atta.szlcsc.com/upload/public/pdf/source/20200306/C422600_1E6D84923E4A46A82E41ADD87F860B5C.pdf; Supplier: LCSC; Type: 厚膜电阻; Tolerance: ±1%; Power(Watts): 100mW; Temperature Coefficient: ±100ppm/℃; Overload Voltage (Max): 75V; Operating Temperature Range: -55℃~+155℃
R55 R86 = 0603WAF2700T5E: 电阻类型:厚膜电阻;阻值:270Ω;精度:±1%;功率:100mW;; LCSC Part Name: 270Ω ±1% 100mW; Supplier Part: C22966; Manufacturer: UNI-ROYAL(厚声); Supplier Footprint: 0603; JLCPCB Part Class: Basic Part; Datasheet: https://atta.szlcsc.com/upload/public/pdf/source/20200306/C422600_1E6D84923E4A46A82E41ADD87F860B5C.pdf; Supplier: LCSC; Type: 厚膜电阻; Tolerance: ±1%; Power(Watts): 100mW; Temperature Coefficient: ±100ppm/℃; Overload Voltage (Max): 75V; Operating Temperature Range: -55℃~+155℃
R56 R87 = 0603WAF3001T5E: 电阻类型:厚膜电阻;阻值:3kΩ;精度:±1%;功率:100mW;; LCSC Part Name: 3kΩ ±1% 100mW; Supplier Part: C4211; Manufacturer: UNI-ROYAL(厚声); Supplier Footprint: 0603; JLCPCB Part Class: Basic Part; Datasheet: https://atta.szlcsc.com/upload/public/pdf/source/20200306/C422600_1E6D84923E4A46A82E41ADD87F860B5C.pdf; Supplier: LCSC; Type: 厚膜电阻; Tolerance: ±1%; Power(Watts): 100mW; Temperature Coefficient: ±100ppm/℃; Overload Voltage (Max): 75V; Operating Temperature Range: -55℃~+155℃
R59 R90 = 0603WAF1602T5E: 电阻类型:厚膜电阻;阻值:16kΩ;精度:±1%;功率:100mW;; LCSC Part Name: 16kΩ ±1% 100mW; Supplier Part: C4210; Manufacturer: UNI-ROYAL(厚声); Supplier Footprint: 0603; JLCPCB Part Class: Extended Part; Datasheet: https://atta.szlcsc.com/upload/public/pdf/source/20200306/C422600_1E6D84923E4A46A82E41ADD87F860B5C.pdf; Supplier: LCSC; Type: 厚膜电阻; Tolerance: ±1%; Power(Watts): 100mW; Temperature Coefficient: ±100ppm/℃; Overload Voltage (Max): 75V; Operating Temperature Range: -55℃~+155℃
RF5-RF8 = BWSMA-KE-P001: 连接器类型:板端;射频系列:SMA;接口类型:内孔;端口数量:1;阻抗:50Ω;频率-最大值:12.4GHz;样式:偏脚;接口直径:5.2mm;接口长度/高度:-;工作温度范围:-;; LCSC Part Name: SMA 内孔 偏脚 SMA偏脚板端座子; Supplier Part: C496550; Manufacturer: BAT WIRELESS(蝙蝠无线); Supplier Footprint: 插件; JLCPCB Part Class: 扩展库; Datasheet: https://atta.szlcsc.com/upload/public/pdf/source/20200416/C496550_06668BF2E3B968EA39F96D17E7156373.pdf; Supplier: LCSC; Connector Type: 板端; RF Series: SMA; Interface Type: 内孔; Number of Ports: 1; Impedance: 50Ω; Frequency-Max: 12.4GHz; Style: 偏脚; Interface Diameter: 5.2mm
U10 U13 = KAQY214STLD: 继电器触点形式:1 Form A(SPST-NO);适用负载类型:AC,DC;正向压降:1.2V;负载电压:400V;连续负载电流:130mA;导通电阻:20Ω;隔离电压:1.5kV;导通时间(Ton):300us;截止时间(Toff):100us;; Supplier Part: C113331; Manufacturer: cosmo(冠西); Supplier Footprint: SOP-4-2.54mm; JLCPCB Part Class: Extended Part; Datasheet: https://atta.szlcsc.com/upload/public/pdf/source/20190409/C113331_605BB640EACA118E8D39C53655D9D82C.pdf; Supplier: LCSC; Relay Contact Form: 1 Form A(SPST-NO); Load Type: AC,DC; Input Forward Voltage: 1.2V; Voltage - Load: 400V; Continuous Load Current: 130mA; On Resistance: 20Ω; Isolation Voltage: 1.5kV; Turn-on time: 300us; Turn-off time: 100us
U11 U14 = 74HC4051D,653: Supplier Part: C9386; Manufacturer: Nexperia(安世); Supplier Footprint: SOIC-16; JLCPCB Part Class: Extended Part; Datasheet: https://atta.szlcsc.com/upload/public/pdf/source/20211209/7A90BCDB54D2694B8637C473CF20976E.pdf; Supplier: LCSC
U17-U20 = TP2604-SR: 运放类型:General Purpose;放大器组数:2;增益带宽积（GBP）:10MHz;压摆率（SR）:6.5 V/us;电源电压:2.7V ~ 36V, ±1.35V ~ 18V;各通道供电电流:1.2mA;; Supplier Part: C126446; Manufacturer: 3PEAK; Supplier Footprint: SOIC-8-150mil; JLCPCB Part Class: Extended Part; Datasheet: https://atta.szlcsc.com/upload/public/pdf/source/20170821/C126446_1503303332965901583.pdf; Supplier: LCSC; Amplifier Type: General Purpose; Number of Circuits: 2; Gain Bandwidth Product（GBP）: 10MHz; Slew Rate（SR）: 6.5 V/us; Supply Voltage（Single）: 2.7V ~ 36V, ±1.35V ~ 18V; Iq per channel (Typ): 1.2mA; Operating Temperature: -40°C ~ 125°C
FPC1 = AFC01-S40FCA-00: 间距:0.5mm;触点数量:40;锁定特性:翻盖式;安装类型:卧贴;触点类型:下接;; LCSC Part Name: FPC 0.5MM 40P 翻盖式 H2.0mm 下接; Supplier Part: C262674; Manufacturer: JS(钜硕电子); Supplier Footprint: P=0.5mm; JLCPCB Part Class: Extended Part; Supplier: LCSC; Pitch: 0.5mm; Number of Contacts: 40; Locking Feature: 翻盖式; Mounting Type: 卧贴; Contact Type: 下接; Height Above Board: 2mm; FFC, FCB Thickness: 0.3mm~0.3mm
FPC2 = AFC01-S06FCA-00: 间距:0.5mm;触点数量:6;锁定特性:翻盖式;安装类型:卧贴;触点类型:下接;; LCSC Part Name: FPC 0.5MM 6P 翻盖式 H2.0mm 下接; Supplier Part: C262655; Manufacturer: JS(钜硕电子); Supplier Footprint: P=0.5mm; JLCPCB Part Class: Extended Part; Supplier: LCSC; Pitch: 0.5mm; Number of Contacts: 6; Locking Feature: 翻盖式; Mounting Type: 卧贴; Contact Type: 下接; Height Above Board: 2mm; FFC, FCB Thickness: 0.3mm~0.3mm
Q5 = S8050_C105433: 晶体管类型:NPN;集射极击穿电压(Vceo):25V;集电极电流(Ic):500mA;功率(Pd):300mW;直流电流增益(hFE@Ic,Vce):120@50mA,1V;; LCSC Part Name: NPN 25V 500mA L档 120-200; Supplier Part: C105433; Manufacturer: CJ(江苏长电/长晶); Supplier Footprint: SOT-23; JLCPCB Part Class: Extended Part; Datasheet: https://atta.szlcsc.com/upload/public/pdf/source/20170415/1492237762328.pdf; Supplier: LCSC; Transistor Type: NPN; Collector-Emitter Breakdown Voltage (Vceo): 25V; Collector Current (Ic): 500mA; Power Dissipation (Pd): 300mW; Collector Cut-Off Current (Icbo): 100nA; Collector-Emitter Saturation Voltage (VCE(sat)@Ic,Ib): 600mV@500mA,50mA; DC Current Gain (hFE@Ic,Vce): 120@50mA,1V; Transition Frequency (fT): 150MHz; Operating Temperature: +150℃@(Tj)
R29 = 0603WAF100JT5E: 电阻类型:厚膜电阻;阻值:10Ω;精度:±1%;功率:100mW;; LCSC Part Name: 10Ω ±1% 100mW; Supplier Part: C22859; Manufacturer: UNI-ROYAL(厚声); Supplier Footprint: 0603; JLCPCB Part Class: Basic Part; Datasheet: https://atta.szlcsc.com/upload/public/pdf/source/20200306/C422600_1E6D84923E4A46A82E41ADD87F860B5C.pdf; Supplier: LCSC; Type: 厚膜电阻; Tolerance: ±1%; Power(Watts): 100mW; Temperature Coefficient: ±400ppm/℃; Overload Voltage (Max): 75V; Operating Temperature Range: -55℃~+155℃
R31 = 0603WAF1001T5E: 电阻类型:厚膜电阻;阻值:1kΩ;精度:±1%;功率:100mW;; LCSC Part Name: 1kΩ ±1% 100mW; Supplier Part: C21190; Manufacturer: UNI-ROYAL(厚声); Supplier Footprint: 0603; JLCPCB Part Class: Basic Part; Datasheet: https://atta.szlcsc.com/upload/public/pdf/source/20200306/C422600_1E6D84923E4A46A82E41ADD87F860B5C.pdf; Supplier: LCSC; Type: 厚膜电阻; Tolerance: ±1%; Power(Watts): 100mW; Temperature Coefficient: ±100ppm/℃; Overload Voltage (Max): 75V; Operating Temperature Range: -55℃~+155℃
C22 C23 = CL10B102KB8NNNC: 容值:1nF;精度:±10%;额定电压:50V;材质(温度系数):X7R;; LCSC Part Name: 1nF ±10% 50V; Supplier Part: C1588; Manufacturer: SAMSUNG(三星); Supplier Footprint: 0603; JLCPCB Part Class: Basic Part; Datasheet: https://atta.szlcsc.com/upload/public/pdf/source/20160103/1457707679526.pdf; Supplier: LCSC; Tolerance: ±10%; Voltage Rated: 50V; Temperature Coefficient: X7R
C24 = 0603B223K500NT: 温度系数:X7R;精度:±10%;额定电压:50V;容值:22nF;; LCSC Part Name: 22nF(223) ±10% 50V; Supplier Part: C77571; Manufacturer: FH(风华); Supplier Footprint: 0603; JLCPCB Part Class: Extended Part; Datasheet: https://atta.szlcsc.com/upload/public/pdf/source/20170923/C77571_1506149542838988940.pdf; Supplier: LCSC; Temperature Coefficient: X7R; Tolerance: ±10%; Voltage Rated: 50V
C25 C26 = 0603B105K250NT: 容值:1uF;精度:±10%;额定电压:25V;材质(温度系数):X7R;; LCSC Part Name: 1uF ±10% 25V; Supplier Part: C59302; Manufacturer: FH(风华); Supplier Footprint: 0603; JLCPCB Part Class: 扩展库; Datasheet: https://atta.szlcsc.com/upload/public/pdf/source/20170923/C59302_1506149498957988854.pdf; Supplier: LCSC; Tolerance: ±10%; Voltage Rated: 25V; Temperature Coefficient: X7R
C28 = CC0603KRX7R9BB103: 容值:10nF;精度:±10%;额定电压:50V;材质(温度系数):X7R;; LCSC Part Name: 10nF ±10% 50V; Supplier Part: C100042; Manufacturer: YAGEO(国巨); Supplier Footprint: 0603; JLCPCB Part Class: 扩展库; Datasheet: https://atta.szlcsc.com/upload/public/pdf/source/20180326/C100042_E8B0111D51DE3671A0A4A59FBCEFE81C.pdf; Supplier: LCSC; Tolerance: ±10%; Voltage Rated: 50V; Temperature Coefficient: X7R
C29-C31 = CL10A335KP8NNNC: 容值:3.3uF;精度:±10%;额定电压:10V;材质(温度系数):X5R;; LCSC Part Name: 3.3uF ±10% 10V; Supplier Part: C51412; Manufacturer: SAMSUNG(三星); Supplier Footprint: 0603; JLCPCB Part Class: Extended Part; Datasheet: https://atta.szlcsc.com/upload/public/pdf/source/20160103/1457707733595.pdf; Supplier: LCSC; Tolerance: ±10%; Voltage Rated: 10V; Temperature Coefficient: X5R
D1 D2 = 1N5819_C437199: 直流反向耐压(Vr):40V;平均整流电流(Io):1A;正向压降(Vf):500mV@1A;; LCSC Part Name: 40V 1A 500mV@1A; Supplier Part: C437199; Manufacturer: KEXIN(科信); Supplier Footprint: SMA; JLCPCB Part Class: Extended Part; Datasheet: https://atta.szlcsc.com/upload/public/pdf/source/20191012/C437199_83583E622A6684E767605E43C169C596.pdf; Supplier: LCSC; Reverse Voltage (Vr): 40V; Average Rectified Current (Io): 1A; Forward Voltage (Vf@If): 500mV@1A
H5 = HDR-F_2.54_1x2P: Supplier Part: C49661; Supplier Footprint: 插件
L2 = GZ1608D601TF: 标称阻抗@测试频率:600Ω@100MHz;误差:±25%;直流电阻(RDC):450mΩ;; LCSC Part Name: 单路 0603磁珠 阻抗600Ω@100MHz; Supplier Part: C1002; Manufacturer: Sunlord(顺络); Supplier Footprint: 0603; JLCPCB Part Class: Basic Part; Datasheet: https://atta.szlcsc.com/upload/public/pdf/source/20210830/355EA7C0FAC5394FC0FE3F17C770C20A.pdf; Supplier: LCSC; Impedance @ Frequency: 600Ω@100MHz; Tolerance: ±25%; DC Resistance: 450mΩ; Current Rating: 200mA; Circuits: 1
LED3 = 204-10SURD/S530-A3-L: 发光颜色:红灯;二极管配置:-;主波长:624nm;色温:-;功率:60mW;安装方式:-;; LCSC Part Name: 红灯; Supplier Part: C99771; Manufacturer: EVERLIGHT(亿光); Supplier Footprint: 插件,D=3mm; JLCPCB Part Class: 扩展库; Datasheet: https://atta.szlcsc.com/upload/public/pdf/source/20170504/1493866972127.pdf; Supplier: LCSC; Emitted Color: 红灯; Lens Color: 雾状红; Dominant Wavelength: 624nm; Peak Wavelength: 632nm; Forward Current: 20mA; Power Dissipation: 60mW; Viewing Angle: 40°; Operating Temperature: -40℃~+85℃; Lamp Holder Type: 3mm圆形灯头
Q3 = AO3401_C727156: 类型:P沟道;漏源电压(Vdss):30V;连续漏极电流(Id):4.2A;功率(Pd):350mW;导通电阻(RDS(on)@Vgs,Id):65mΩ@10V,4.2A;阈值电压(Vgs(th)@Id):1.3V@250uA;栅极电荷(Qg@Vgs):-;输入电容(Ciss@Vds):-;反向传输电容(Crss@Vds):-;工作温度:-;; LCSC Part Name: P沟道 30V 4.2A; Supplier Part: C727156; Manufacturer: TWGMC(台湾迪嘉); Supplier Footprint: SOT-23; JLCPCB Part Class: Extended Part; Datasheet: https://atta.szlcsc.com/upload/public/pdf/source/20200827/C727156_6E081BBEEFBC6B8FEE164CB196B0AF30.pdf; Supplier: LCSC; Type: P沟道; Drain Source Voltage (Vdss): 30V; Continuous Drain Current (Id): 4.2A; Power Dissipation (Pd): 350mW; Drain Source On Resistance (RDS(on)@Vgs,Id): 65mΩ@10V,4.2A; Gate Threshold Voltage (Vgs(th)@Id): 1.3V@250uA
SW5 = 拨动开关_侧: Supplier Footprint: 插件
U6 = RT9193-33GB: 输出类型:固定;输出极性:正;输出通道数:1;最大输入电压:5.5V;输出电压:3.3V;压差:300mV@(300mA);输出电流:300mA;电源纹波抑制比(PSRR):70dB;; LCSC Part Name: 正 Vin=5.5V Vout=3.3V 300mA 70dB; Supplier Part: C15651; Manufacturer: RICHTEK(立锜); Supplier Footprint: SOT-23-5; JLCPCB Part Class: Extended Part; Datasheet: https://atta.szlcsc.com/upload/public/pdf/source/20130730/1457706628575.pdf; Supplier: LCSC; Output Type: 固定; Output Polarity: 正; Number of Outputs: 1; Maximum Input Voltage: 5.5V; Output Voltage: 3.3V; Dropout Voltage: 300mV@(300mA); Output Current: 300mA; Power Supply Rejection Ratio (PSRR): 70dB
U7 = TP4056_C725790: Supplier Part: C725790; Manufacturer: UMW(友台半导体); Supplier Footprint: ESOP-8; JLCPCB Part Class: Extended Part; Datasheet: https://atta.szlcsc.com/upload/public/pdf/source/20211011/37515E71BA298E23D23475482C49633D.pdf; Supplier: LCSC
U8 = RS3236-3.3YF5: 输出类型:固定;输出极性:正;最大输入电压:7.5V;输出电压:3.3V;输出电流:500mA;电源纹波抑制比(PSRR):70dB@(1kHz);; LCSC Part Name: 输入7.5V 输出3.3V 500mA; Supplier Part: C379349; Manufacturer: RUNIC(润石); Supplier Footprint: SOT-23-5; JLCPCB Part Class: 扩展库; Datasheet: https://atta.szlcsc.com/upload/public/pdf/source/20190312/C379350_C6E838C63CD1E04DE7C7AC39BE8996D9.pdf; Supplier: LCSC; Output Type: 固定; Output Polarity: 正; Number of Outputs: 1; Maximum Input Voltage: 7.5V; Output Voltage: 3.3V; Dropout Voltage: 550mV@(300mA); Quiescent Current (Ground Current): 40uA; Output Current: 500mA; Power Supply Rejection Ratio (PSRR): 70dB@(1kHz); Operating Temperature: -40℃~+85℃@(Ta)
U9 = SGM3204YN6G/TR: 可输出电流:Up to 200mA;最大输入电压:5.5V;; Supplier Part: C194031; Manufacturer: SGMICRO(圣邦微); Supplier Footprint: SOT-23-6; JLCPCB Part Class: Extended Part; Datasheet: https://atta.szlcsc.com/upload/public/pdf/source/20180627/C194031_755051E53122D645C36CF727711B963E.pdf; Supplier: LCSC; Voltage - Output (Min/Fixed): -1.4V; Voltage - Output (Max): -5.5V; Current - Output: Up to 200mA; Frequency - Switching: 950kHz; Output Type: Adjustable; Voltage - Input (Min): 1.4V; Voltage - Input (Max): 5.5V; Function: Charge Pump; Output Configuration: Negative
USB1 = U262-061N-4BVC11: 连接器类型:Type-C;标准:USB 3.1;公母:母座;触点数量:6P;端口数量:1;安装方式:卧贴;额定电流 - 电源:5A;触头材质:铜合金;触头镀层:金;工作温度范围:-25℃~+85℃;焊接温度(最大值):260℃;; LCSC Part Name: Type-C 母座 卧贴; Supplier Part: C2764612; Manufacturer: XKB Connectivity(中国星坤); Supplier Footprint: SMD; JLCPCB Part Class: Extended Part; Datasheet: https://atta.szlcsc.com/upload/public/pdf/source/20210602/C2764612_915BA3D27A0B76A9D989108E3A082B29.pdf; Supplier: LCSC; Connector Type: Type-C; Standard: USB 3.1; Gender: 母座; Number of Contacts: 6P; Number of Ports: 1; Mounting Style: 卧贴; Current Rating - Power (Max): 5A; Contact Material: 铜合金; Contact Plating: 金; Operating Temperature Range: -25℃~+85℃; Welding Temperature (Max): 260℃

## Nets
+3.3V: C6.1 C13.2 C14.2 C15.2 C16.2 C18.2 C19.2 C26.1 FPC1.6 FPC1.7 FPC1.33 FPC1.39 FPC2.1 H1.1 H1.2 H3.1 H4.1 L1.2 R1.2 R7.2 R9.2 R25.1 R26.2 R27.1 R30.2 R93.2 U4.8(VCC) U8.5(OUT) U16.6(VBAT) U16.11(VDD) U16.19(VDD) U16.28(VDD) U16.50(VDD) U16.75(VDD) U16.100(VDD)
+3.3V_A: C17.2 C23.1 C30.2 C32.2 C40.2 D3.1(K) D6.1(K) R24.2 R32.2 R47.2 R56.2 R57.2 R63.2 R68.2 R87.2 R88.2 U6.5(VOUT) U9.2(IN) U11.16(VCC) U14.16(VCC) U16.22(VDDA) U17.8(+VS) U19.8(+VS)
-3.3V: D4.2(A) D7.2(A) L2.1 R46.1 R78.1 U11.7(VEE) U14.7(VEE)
GND: C1.2 C2.1 C3.1 C4.1 C5.1 C6.2 C7.1 C8.1 C10.2 C11.2 C13.1 C14.1 C15.1 C16.1 C17.1 C18.1 C19.1 C20.1 C21.1 C22.2 C23.2 C24.1 C25.1 C26.2 C27.1 C28.1 C29.2 C30.1 C32.1 C34.1 C36.2 C37.2 C38.2 C39.1 C40.1 C42.1 C44.2 C45.2 C46.2 C47.1 D5.2(A) D8.2(A) FPC1.5 FPC1.16 FPC1.37 FPC1.38 FPC1.40 FPC1.41 FPC1.42 FPC2.2 FPC2.7 FPC2.8 H1.5 H1.6 H3.3 H4.2 H5.2 Q5.2 R18.1 R23.1 R36.1 R49.1 R58.1 R59.1 R70.1 R80.1 R89.1 R90.1 RF5.1 RF5.2 RF5.3 RF5.4 RF6.1 RF6.2 RF6.3 RF6.4 RF7.1 RF7.2 RF7.3 RF7.4 RF8.1 RF8.2 RF8.3 RF8.4 SW1.3 SW1.4 SW3.5 SW3.C SW4.5 SW4.C SW5.4 SW5.5 TP1.1 TP2.1 TP3.1 TP4.1 U4.1(A0) U4.2(A1) U4.3(A2) U4.4(GND) U4.7(WP) U6.2(GND) U7.1(TEMP) U7.3(GND) U7.9(EP) U8.2(GND) U9.4(GND) U11.6(E) U11.8(GND) U14.6(E) U14.8(GND) U16.10(VSS) U16.20(VSSA) U16.27(VSS) U16.74(VSS) U16.99(VSS) U17.4(-VS) U19.4(-VS) USB1.7(EH) USB1.8(EH) USB1.9(EH) USB1.10(EH) USB1.A12(GND) USB1.B12(GND)
VBUS: C20.2 C21.2 D1.2(A) R15.2 R21.1 R23.2 U7.4(VCC) U7.8(CE) USB1.A9(VBUS) USB1.B9(VBUS)
VCC_IN: D1.1(C) D2.1(C) Q3.2(S) SW5.2
VCC_OUT: C22.1 C25.2 SW5.3 U6.1(VIN) U6.3(EN) U8.1(IN) U8.3(EN)
-INA: C35.2 U11.3(Z) U18.2(-)
-INA2: C43.2 U14.3(Z) U20.2(-)
AC_IO1: U10.2(K) U16.31(PA6)
AC_IO2: U13.2(K) U16.15(PC0)
ADC1: C37.1 D5.1(K) R54.2 U16.25(PA2)
ADC2: C45.1 D8.1(K) R85.2 U16.26(PA3)
BOOT0: R3.1 U16.94(BOOT0)
BOOT1: R2.2 U16.37(PB2-BOOT1(PB2))
CTP_INT: FPC2.5 U16.91(PB5)
CTP_RST: FPC2.6 R25.2 U16.96(PB9)
CTP_SCL: FPC2.3 R26.1 U16.92(PB6)
CTP_SDA: FPC2.4 R27.2 U16.93(PB7)
DAC_OUT1: R61.2 U16.29(PA4)
DAC_OUT2: R62.2 U16.30(PA5)
DB0: FPC1.17 U16.61(PD14)
DB1: FPC1.18 U16.62(PD15)
DB2: FPC1.19 U16.81(PD0)
DB3: FPC1.20 U16.82(PD1)
DB4: FPC1.21 U16.38(PE7)
DB5: FPC1.22 U16.39(PE8)
DB6: FPC1.23 U16.40(PE9)
DB7: FPC1.24 U16.41(PE10)
DB8: FPC1.25 U16.42(PE11)
DB9: FPC1.26 U16.43(PE12)
DB10: FPC1.27 U16.44(PE13)
DB11: FPC1.28 U16.45(PE14)
DB12: FPC1.29 U16.46(PE15)
DB13: FPC1.30 U16.55(PD8)
DB14: FPC1.31 U16.56(PD9)
DB15: FPC1.32 U16.57(PD10)
EC11A1: SW3.1 U16.59(PD12)
EC11A2: SW4.1 U16.23(PA0-WKUP(PA0))
EC11B1: SW3.2 U16.60(PD13)
EC11B2: SW4.2 U16.24(PA1)
FREQ_C1: R45.2 U16.4(PE5)
FREQ_C2: R69.2 U16.53(PB14)
FSMC_A16: FPC1.10 U16.58(PD11)
FSMC_NE1: FPC1.9 U16.88(PD7)
FSMC_NOE: FPC1.12 U16.85(PD4)
FSMC_NWR: FPC1.11 U16.86(PD5)
HC1_0: U11.11(S0) U16.71(PA12)
HC1_1: U11.10(S1) U16.70(PA11)
HC1_2: U11.9(S2) U16.67(PA8)
HC2_0: U14.11(S0) U16.17(PC2)
HC2_1: U14.10(S1) U16.18(PC3)
HC2_2: U14.9(S2) U16.33(PC4)
I2C2_SCL: R7.1 U4.6(SCL) U16.47(PB10)
I2C2_SDA: R9.1 U4.5(SDA) U16.48(PB11)
KEY1: SW3.T U16.63(PC6)
KEY2: SW4.T U16.64(PC7)
LED: LED2.1(C) U16.97(PE0)
LEDK: FPC1.34 FPC1.35 FPC1.36 R29.2
OSC32_IN: C5.2 U16.8(PC14-OSC32_IN(PC14)) X2.1(OSC1)
OSC32_OUT: C3.2 U16.9(PC15-OSC32_OUT(PC15)) X2.2(OSC2)
OSC_IN: C4.2 U16.12(PH0-OSC_IN(PH0)) X1.1
OSC_OUT: C2.2 U16.13(PH1-OSC_OUT(PH1)) X1.3
OUTA: C35.1 R43.2 R52.1 U11.12(Y3) U18.1(OUTA)
OUTA2: C43.1 R77.2 R83.1 U14.12(Y3) U20.1(OUTA)
RST: FPC1.15 H3.5 SW1.2 U16.14(NRST)
RX1: H4.3 U16.69(PA10)
SWCLK: H3.2 U16.76(PA14(JTCK-SWCLK))
SWDIO: H3.4 U16.72(PA13(JTMS-SWDIO))
TFT_BL: R31.1 U16.95(PB8)
TX1: H4.4 U16.68(PA9)
$C1_1: C1.1 R1.1 SW1.1
$C7_2: C7.2 C8.2 L1.1 U16.21(VREF+)
$C10_1: C10.1 U16.49(VCAP_1)
$C11_1: C11.1 U16.73(VCAP_2)
$C24_2: C24.2 U6.4(BP)
$C27_2: C27.2 D2.2(A) H5.1 Q3.3(D) U7.5(BAT)
$C28_2: C28.2 U8.4(BP)
$C29_1: C29.1 L2.2 U9.1(OUT)
$C31_1: C31.1 U9.6(CFLY+)
$C31_2: C31.2 U9.3(CFLY-)
$C33_1: C33.1 RF5.5 U10.3(S1)
$C33_2: C33.2 R48.2 U10.4(S)
$C34_2: C34.2 R47.1 R49.2 U17.2(-)
$C36_1: C36.1 R46.2 U18.4(-VS)
$C38_1: C38.1 R57.1 U18.8(+VS)
$C39_2: C39.2 R56.1 R58.2 U17.5(+)
$C41_1: C41.1 RF6.5 U13.3(S1)
$C41_2: C41.2 R79.2 U13.4(S)
$C42_2: C42.2 R68.1 R80.2 U19.2(-)
$C44_1: C44.1 R78.2 U20.4(-VS)
$C46_1: C46.1 R88.1 U20.8(+VS)
$C47_2: C47.2 R87.1 R89.2 U19.5(+)
$D3_2: D3.2(A) D4.1(K) R53.2 U18.5(+)
$D6_2: D6.2(A) D7.1(K) R84.2 U20.5(+)
$H1_3: H1.3 R2.1
$H1_4: H1.4 R3.2
$LED2_2: LED2.2(A) R93.1
$LED3_1: LED3.1(A) R15.1
$LED3_2: LED3.2(K) U7.7(CHRG#)
$Q3_1: Q3.1(G) R21.2
$Q5_1: Q5.1 R30.1 R31.2
$Q5_3: Q5.3 R29.1
$R18_2: R18.2 U7.2(PROG)
$R24_1: R24.1 U9.5(EN)
$R32_1: R32.1 U10.1(A)
$R33_1: R33.1 R45.1 U17.1(OUTA)
$R33_2: R33.2 R44.2 U17.3(+)
$R34_1: R34.1 R37.2 R38.1 U11.4(Y7)
$R34_2: R34.2 R38.2 R39.1 U11.2(Y6)
$R35_1: R35.1 R40.2 R41.1 U11.15(Y2)
$R35_2: R35.2 R41.2 R42.1 U11.14(Y1)
$R36_2: R36.2 R37.1 U11.5(Y5)
$R39_2: R39.2 R40.1 U11.1(Y4)
$R44_1: R44.1 R50.2 R54.1 U17.7(OUTB)
$R48_1: R48.1 R51.2
$R50_1: R50.1 R52.2 U17.6(-)
$R51_1: R51.1 R53.1 R55.2
$R55_1: R55.1 R59.2
$R61_1: R61.1 RF7.5
$R62_1: R62.1 RF8.5
$R63_1: R63.1 U13.1(A)
$R64_1: R64.1 R69.1 U19.1(OUTA)
$R64_2: R64.2 R66.2 U19.3(+)
$R65_1: R65.1 R71.2 R72.1 U14.4(Y7)
$R65_2: R65.2 R72.2 R73.1 U14.2(Y6)
$R66_1: R66.1 R81.2 R85.1 U19.7(OUTB)
$R67_1: R67.1 R74.2 R75.1 U14.15(Y2)
$R67_2: R67.2 R75.2 R76.1 U14.14(Y1)
$R70_2: R70.2 R71.1 U14.5(Y5)
$R73_2: R73.2 R74.1 U14.1(Y4)
$R76_2: R76.2 R77.1 U14.13(Y0)
$R79_1: R79.1 R82.2
$R81_1: R81.1 R83.2 U19.6(-)
$R82_1: R82.1 R84.1 R86.2
$R86_1: R86.1 R90.2
$U18_3: U18.3(+) U18.6(-) U18.7(OUTB)
$U20_3: U20.3(+) U20.6(-) U20.7(OUTB)
Y0: R42.2 R43.1 U11.13(Y0)

Not connected (* = marked no-connect by the designer): FPC1 1* 2* 3* 4* 8* 13* 14*; SW5 1*; U7 6(STDBY#)*; U16 1(PE2)* 2(PE3)* 3(PE4)* 5(PE6)* 7(PC13)* 16(PC1)* 32(PA7)* 34(PC5)* 35(PB0)* 36(PB1)* 51(PB12)* 52(PB13)* 54(PB15)* 65(PC8)* 66(PC9)* 77(PA15(JTDI))* 78(PC10)* 79(PC11)* 80(PC12)* 83(PD2)* 84(PD3)* 87(PD6)* 89(PB3(JTDOTRACESWO))* 90(PB4(NJTRST))* 98(PE1)*; USB1 A5(CC1)* B5(CC2)*; X1 2(GND)* 4(GND)*

## Notes on the sheets
sheet 2
- 负电压电荷泵
  电压：-3.3V
  电流：200mA（MAX）
sheet 4
- 通过光耦选择耦合方式
  衰减电路
  衰减系数：1/50
- 频率计
- 频率计
- 通过光耦选择耦合方式
  衰减电路
  衰减系数：1/50
